# Altium schematic sheet Power supply.SchDoc (part 3 of 6)
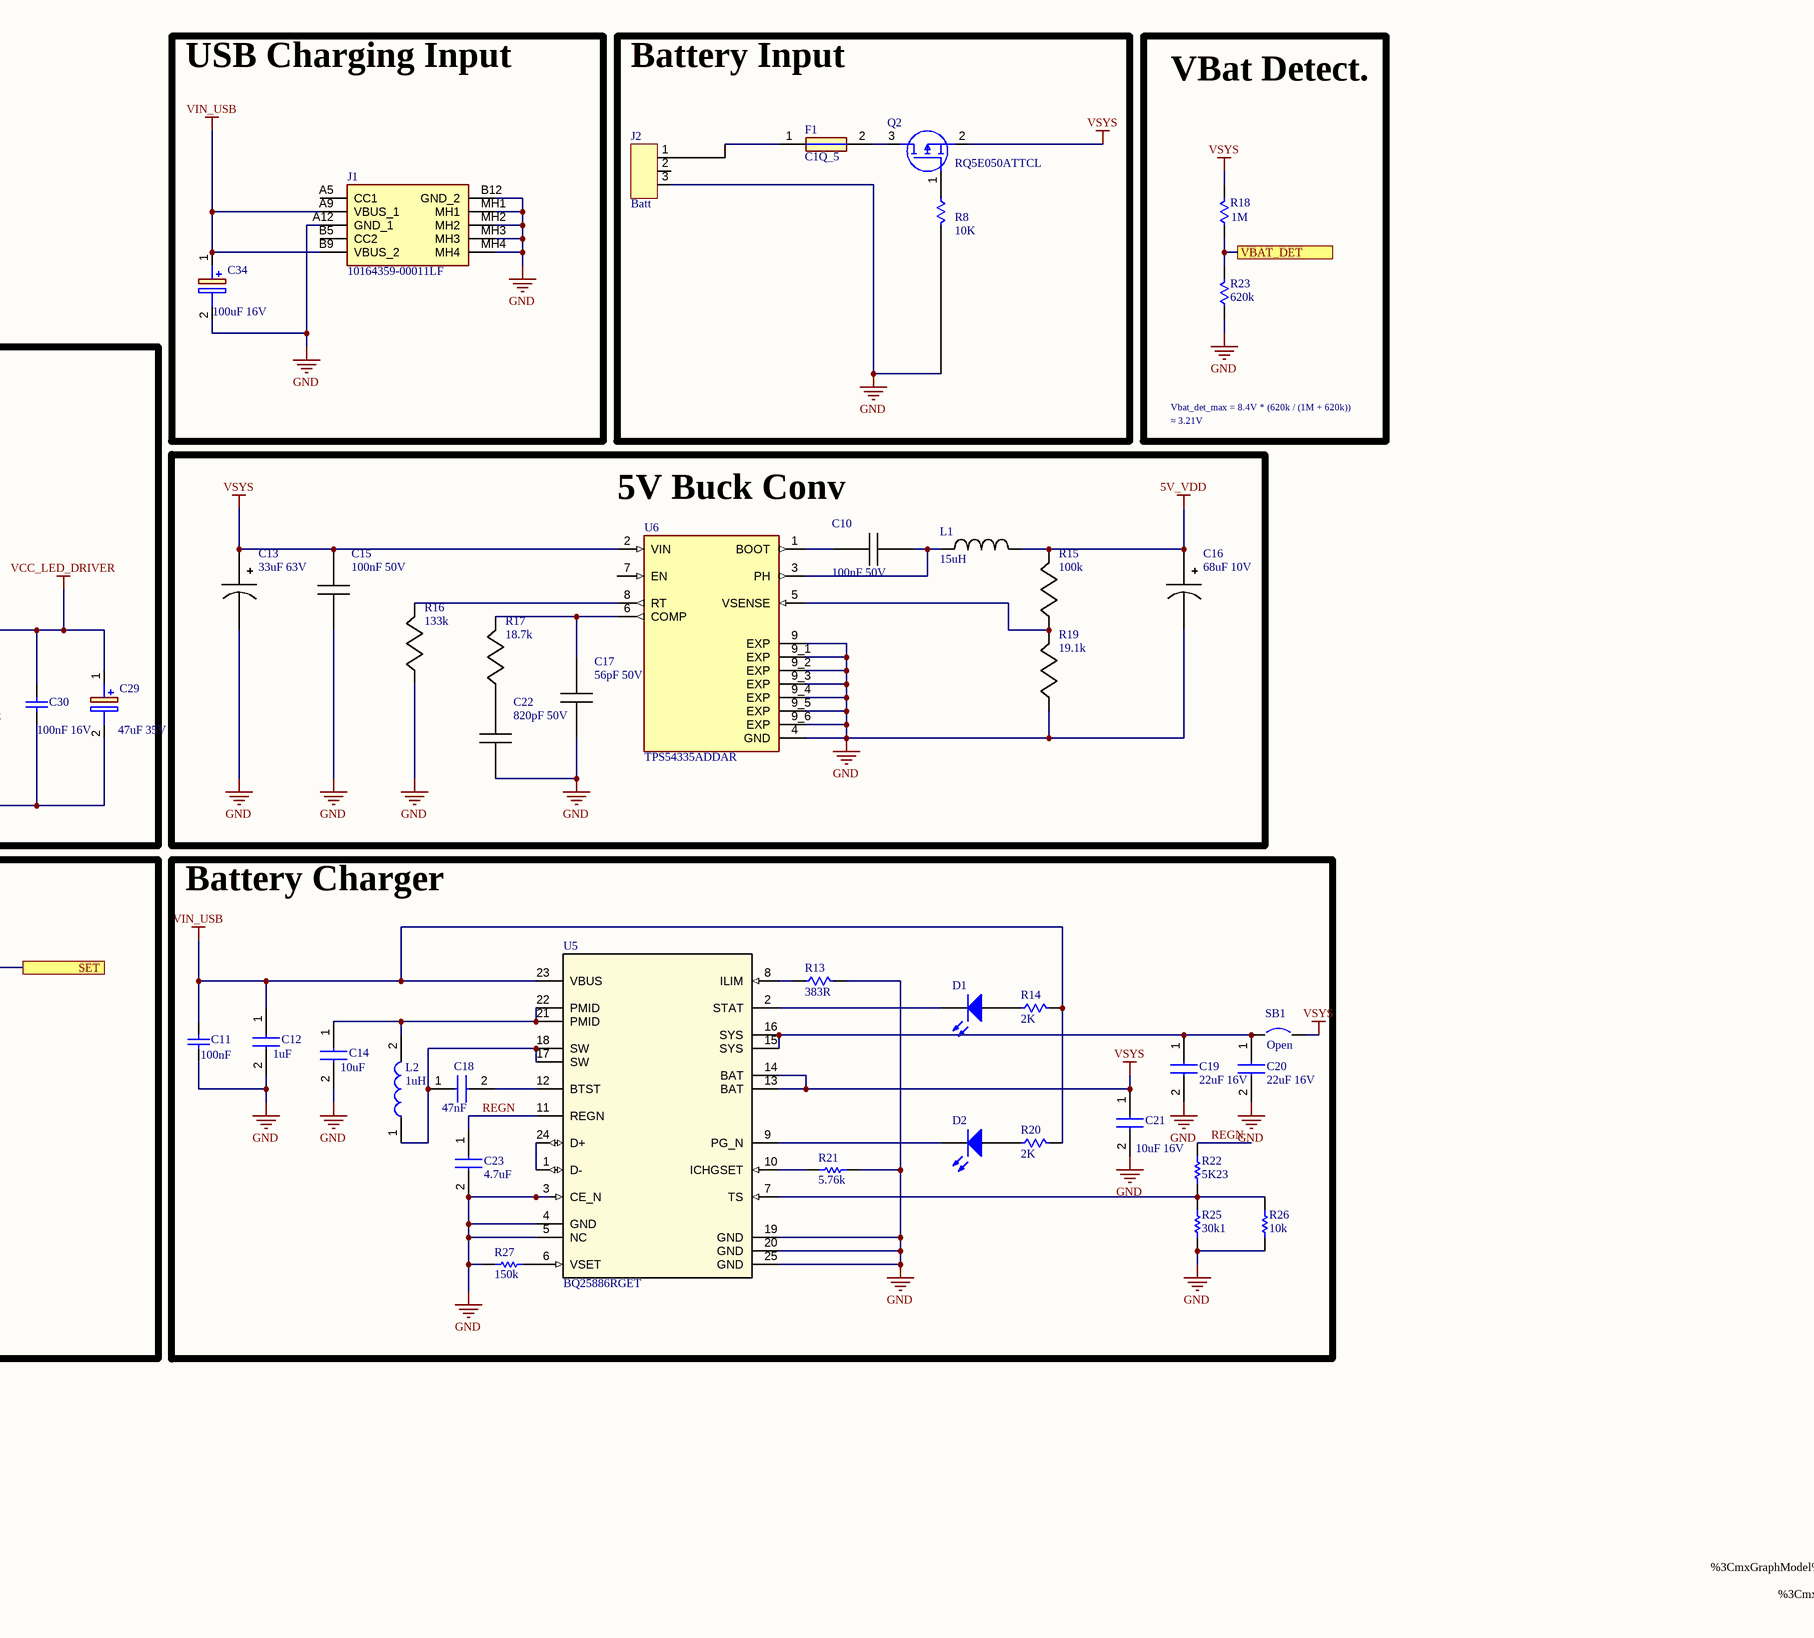
[diagram p3: Power supply.SchDoc, right]

## Notes on the sheet (continued)
797N0NHBMiwkMCYqHFZUCbPTkXLgFjFR4f5%2B7o4OljbWppASb%2F1qAlYWxpGhQzOTRqvnm%2BzVFJK8Cwp1IiIi1Gjh%2BkvUq4E3FHTajzhHDzqbNkZHrY7Yt2%2Ff7t27v%2FvuO5IY2m24sbHx8uXLsKastLS0oaGBLGpTU1NsbOz%2Blo3nMJw81W7DOHXVqkTH0cFy3rxAZBqU6GgFdKwsjDXR0WmoF7dqQ48cdXQXFmy1LcgJOVouJnehqNnMNAk6q0IsxCKeTkHnY9e%2Fb9y6l7LvF6wA0HnLuPOuLVN3bg8l98T4oA9sTbp3M4TlY%2F5%2B7v5%2B7qC9RDYPmMlKESRs2xK7bUssLqrXXa12gJxJoY56Y7b%2BKjVq4A0FHdCsZPBs9Sq%2FKLoyslPL9oZIdB4%2F%2FuHixQunTp26du1au%2BUAVQt29%2B7dCy2bqhe2VXr2oBMT1Sx70xHomJsZZSaNRvVSVXu0G1c2sTSfo%2BsPXLDVNjPZe%2FuGQHL%2FNnpWm4AOxf%2BD%2BGJDydGkL3wH9OrZJSRo8GFFlpERdMh5KwhTdHQoCWSyJl3X7euePwp19IaSVf3A1U7%2FJoIOG89Wr%2FJbesNBp62G9nZ4319%2B%2BeXJHxuDB6tm3zq1tdKWjcFAkUoP2H5AJzRoMDo%2FUrVfu1g25VV%2BuQz3Emy1Tdk0jDIlNOfjLgg67%2FTrxuFw%2FH36r19lqQuJzjv9uhkaNk9ONfu6unCbupfHwRxfqdA%2B%2F3DE%2FqwD5C5IWYOgUyOtDgsJJHd86pfGnd3tHR0sccez%2BoCyGtALdVT9rjVP%2FyaCTrsS5%2BinrlQajztw4l9%2B%2BUUqlfr4%2BPD5%2FOjo6OvXryt72Nu3b8fFxfH5fCcnJ6lU%2Bvz5c2Up2ce3H9CxsjA%2BmeeiRtd2vzZXvXmrvn26du1i2LmTgRb3d%2Fp127I2kA46nu72cBdyub6jo3ZWXb37rhk%2BAofDMTQ0eN%2FyrcN7x5Dquhie5NHP5O3On01pdqRF3z%2BwNenaxXDKZDfzgX%2Fr3s3Q0NCgezfDPr26UgZvisoO5az%2BUFkN9O3TFRqAXqijxpeuxiVvHOi0N3EOA%2BhMnDjR7a%2Bbs%2FPLBRQ4cdABVl2xH4w7dkoAnc8%2F%2F5wN6Kxbtw7s07Qf0JkwYcLEv25qrLqCgUE9X1eq%2BuCEexn36MThcLp3M%2Bxh1Em7e8GhODroBAZ%2BSd6Fz%2B3D5%2FbRFuhM4A%2Fnc%2FtYDTOGW7zbvzt4zaRzTMmhsaijQz8rFvE%2BsG12nA7aysOGGI%2Fn9hk2xNjAwKCHUSdlgzdDPHgUCZo1UFW71Qx5vtanUKijd2muBrWocckbBzrw9bYT7Rz4VhVOXdGHDRhEgHX0oNPxoOeXX35pbGwsLS0tKyu7efMmg3cwmUx2%2B%2FZtqVR69epVrU9dHTta0K9vN4Z9ZUQYXUdHWXMF1mG%2FvBxHr7i1I25c2cS%2BR7tcPkONpcVAOW8bd8b7ajFQJFQAOqjgAjcCyNDF1BXkb2v91nhuH%2Fr%2Bga0Jgg797Hhun7eMuwDl7Fj%2FPpLQqhALAwODXj27qFRL5Er7UqE96mKrlEnHS4yaOklJSezbuT6lejXwZoFOUlISgE7fPlQZbBt%2BSHTQUTZsIOtQQOfDMcPoI5PPpIkdjwb0T6SjGsCpq1YtIwcHB1NAx8XFxVX5NnHiRJVcQMCXaGVhHLd2BBubOo1Pai%2BWTVGbcsz696mvv%2Fu7A86P3OxBr1aYnU7%2FmtSIUQg6X381l8xqx%2Fr3d6x%2FX1ugE7rowx3r35826R24RZ9eL%2BdHoNNT47dZv0fEq72a%2BOT7K9JzS3938T1siHHXLobse0tw8X25fMbDupIbVzaJRTxV1%2F%2Bzv9frlfLd%2Ft3hjTg5Oak3eOuvYl8DbxboDBw4ENoWwyfh620aFjRYbSlr0KyBkaFDVVr6QQEdbfm64vP5WhwU79%2B%2Ff%2BeP7dmzZ5BzXV3dH3F3UALx8OHD%2Bj82jNRiSfRZ6aIGEHSOHCl4p183hj1q9VISdEjmZhNevnx5VsYucBnN%2FOfeysI4aNbAy%2BUz7tfmKuzRmp42XLsUVZBqp4ancZTlgFVf14kTgHKqqqrkcnlwcLAaWEC5JCbiS%2FrUlbOzMyUZh8PR1tSVmZkZPXMDRRslmaIkzXEgzvnXv%2F71%2F%2F7f%2F%2FvPb89e%2FPKo9ubV995rNkuYIkior79bX38XF5wLs9MgBrxfQR8L4pwn31%2BBNwheGl6jCSxfb9NQnQ0HaDFSIpEobOH6SG3VwBsEOijOYRC9ZiWNkoi4sJcJxzJ3xBRa4nN747USETd%2BrTUlgbJDCuiwGS3INBKJ5MMxw9Yss0hNsMWdO6bnFB9XLY6INTU1sMxHKpX%2B9NNPkDMZ2djYCJEwqwKJv%2F%2F%2Bey2WQZ%2BV7moAQQfHLWXNlbK8nGyKbMLLly9%2FdOcQzoa06prKbqRJZOjQc8Vu0nNLa6WJ92tz79fm1koTq88GFaTaqerCEx4KKcfczEgmazp16hSHw5HL5VmZafYfDpfL5Tt3xiEKmLzduV%2FfZvLr26ercY9OYFC41d8B73R3HG1EBx2QiODlw977rw9sTbQFOnYfDEHdGiy%2Fv0%2F%2F%2FQkjm%2Fc98%2Fbvmbcu2n3wINOAgICEP7awsDCbEQO2r58CCV4mThi5JGAQOAZ%2F%2BmONXC7%2F978e%2FSy7KZfLnz59um1LLFhDBts5JcWFYEO5RloN4IhGFwF0GurFJOgoa1rtLV6TSTf0rA5NXWE7H2CqF%2Bpoi2RayecNAp1WxTmRoUMlIm712aCHdSU3r2yUiLiCrTbsv72C1DESEVd6LuxhXUlV%2BXSJiBs0ayCbyzUHnYhQnkTEvVw%2BnSy5di0jC%2FdMFyb6CBN90jd9eP9ONYy4x7K%2BwsgHd85D5PkT8XkpM4rSF%2BalzLh1tVh3Y7M%2BZy3WwCsGnVpp4sO6Evh%2Fz%2BbvxO9Lsfjc3r7epkGzBs7wG%2BDp0ldtqQBJOQA6dXV1Yz8cLZfLhdnpYBZv08Z%2FcjgcleZoKF%2B6YKtt2k7nNUsnkPuKJXxcXg7pdaGjY%2FHef%2BHaq86dDcAmofioG1jTWbBoKd1Q8vjx49esTXhpbuePRVieLn2heLeuNGPNldOzSg6N3bdvn1wuj4kKRyCur78LjlHBgo6NtalcLsezkMm5Yrdrl6Lgdau3Mo5Sva%2FgUMNJt%2FwW3xTSc0sf1pVUnw0Si3gKh4MeRs268BwORy%2FUaQVVNDv9poAOinOMeyhdNQDiHDRWdqnMRyLisv%2BiJCLu%2BWJXeB1Pvr%2FCXqijOegUC70lIi7Kh6Hk9mMG%2BPm6iYoO04fDAwcOLFu2LDo6Ojc3l35WYUz6hpHxYRzYHz%2B6AWkKBZMwEkHnWPoMjLz230KFuekjX2UNVFdXg39yhd7LGxoahEJhbGxsRETEzZs3cYhS1vI1l%2BjIfroGnwk4YiRdFii7KT3e38%2B9UlJRI62ulFT4%2B7nXSKthF2anwcQKxtRIq9F3FYVyjHt0mj17Npq88%2Fdzh%2FAwi%2Fc4HA79puxj2FhGNjcz0grozJkzp7Gxcc6cOXQXEL7epnALNUAHyLLk0NijeSvkcnnCxk%2FeMu6Sl5cnl8thVXmKIAG1mmDSCuqHBB1zMyMgBijGa6SgA%2BIcHA5UdY0OwjAcDn5Xb1Loha1f32ZzShwOR6%2BpoxnJtHI159mbsdna2kJ7GmDaXVlvJdhqIxFxv79%2FBqoE5qGUJabEW1kYA%2BjAtfduHX71oIMlP1%2FsSiLa7qRt5LC6bNmyucQWHx9PnlUWJkHn%2B%2FqXjhr0oKOsutpP%2FIULFyKJLTY29saNl5z64sWLhoYGPDnWbhhliKI0cjj83UxcVFQUm1kqhWmWL18u%2B%2BkafCZ3rqWKRbzQIKorSoX3pUSC6AUmUGDeRCZrAu%2FZJcWFlZIKOMQYczMjOuVwOJz%2B7%2FQBDwaODpbmZka%2Fyyq49sM5HA7DBDelJAoPf3e9JMpdLBSVkLsgI5si0eFze%2FO5vTV06unl5SUQCMaPH%2B%2FSvLy8NynrUht0VoVY%2FK13V5A3kCwol8trpNXwyGEhgZWSCnATwQA65mZGVhbGni591VClUli3ryYSQOf7%2B2ehrZ4rdlPJfgGADlz7%2Ff2zDFrYXbsYcjgcExMTsVgM6fW%2FWq%2BBNwJ0pFIpUA6zEQhPl74AK99dXA1CkfUrh7P%2FqNavHN4y8zX%2Fu4urAZJYqiRrLtEJnGUHJZdWhtFLbmNt%2BvjxDzD0ZmRkEJDzMnjs2LFWB2YSdBoevPTV0Cro1Fw81GrO%2BgQvXry4e%2FfuNypuLOsNOQYDO3bswGvT09MxfhzPhiXorFmzRiHEsIkEHZ0rZ4OuVobBv3y1xz9hdhpIFwB0zM2MbKxNyREXjFTJ5fKwkECFlGPcoxOQUI20GkDH3MwI%2FmS%2F068b%2B2%2BfnhKGyVP5TuQOz0ufquM6fOgzie8ziW%2FfstHDcGqiiyOegvBEF0d7e3uMH2H1LqUkaoPOx65%2Fh8k74x6dvv5qLtAMyG%2F8%2FdxTBAkyWZO%2FnztUOE5d2VibOjpYsmlFlHK2w0OcdPvuojqTbutWWopFvMvl07%2B7GAXvXdlwgEKdFStWaH2A12cINfBGgM4XX3wBoNOvbyudV9CsgahQzF6bGL5SKwtjkAlBDjP9BrD8ejUHHUcHy5l%2BA7DkdNWiiooyGNuio6PpoMNGqFOQMi0vZUZeyoysOBecuhKlzYFIYaLPg7tX4Ran8r7JinPJinNJ3%2FShXkcHkYI5cPLkSfCF3urvlClT%2BHy%2Bp6cnc4Zw9saNG8gxZKCpqQkSkJERERHV1dVspq40Bx3o%2BsUinhrLwvGzooOOuZkRCTqgKpsiSFBGOeZmRv5%2B7qBaWyOtBu%2BVn3i7cjicd%2FsrFf1iARgCpB4rPqwy0LGyMIZTbxl35nA4YMt42Hv%2F9W7%2F7hC%2FNcaKw%2BHAGqikTe%2F%2FbuFw%2FarmcRRwBLRwUN3VxtpUJmuCpU%2BagE7nzgbwgGEhgXK53NPd3tO9eQW%2BTNaE4jRAn21bYiENHMrlcn8%2Fd4bKeV1OaTLp1jIc2OKrZxBbovFAExMTPZfoqAbeCNABymFpJBDUHknxr0qfJZ%2FbW9W%2BWyugA%2FJhiuAaS15VdREGtg0bNtBBJzk5udVRk1xgpV911Wp1qZqAJejEx8dfvXp12bJlGoIOFi82NhZZJyIiYtWqVa8AdFIECWp8JtiYMUABHZDNgE4xynKYKQezQnUTGKqDg4NfMeisX2Xp79MfeqqkTTYFqXYWLaBTkGpXkGq34qshHA7n63mDC1Lt1kY0z6ytDrMoSLWbPnUAh8P5wNbE36f%2FuwOMOBxOz549nz59Ck%2Bxb98%2BDocTPG9w83B71O3sxYazFxtYKiN%2F7Pp3BB1HB0tcReXpbg9hfz93YXa6MDs9JiocqjEsJBBiOgblwEO9muHA5O1mwOVwOImJiToa6d%2FwbDs%2B6CQmJkIbaldGArGHpbuAYCP%2FJ9NIJJLRoyz69OrKsOPAVl5eTgedq1dfCmMwGT1w%2B%2Fbt2j82tI5z7969P%2BJq0UTvo0ePbvyxoeSAnqE%2BhqwBlqATEBCQm5vr4%2BPDEnSamppIlAGmSU9Px1sXFha2CeiQ7V%2FVsL%2BfO8ybgIKIjbUprm2ukb6USMEpNpTj6GAJ0giZrAlcVy5ZPLdViQ5aQIG%2BRbu%2FoEfYtYth925%2FmuaDFem%2F61mDoTmchadYBRw1alRdXR2ADth%2B%2FNj176tCLFaFjVy1lLdqKW9RgEXzvmhBQvwm2D08PGyt%2B4QtGgUJmhOHWAwbYoygo%2BoL0qdXtQZI44FvOJHo6PE7Pui0uqpc1Uap9fQUiY67u7sL4zZx4kQK6AwaNIihqz1%2B%2FDgObE%2BfPo2PjydZJyMjA8%2FqA21VAyxBBye2WILOixcvqqurEWUiIyM3b95M0mdTU1NycjIkAInOkSMFxj06Mezh4SHk1JWnp6eTk9M45ZuTk5MaLiAYvjJcG4WKsaijg1eB1gjDjBWZEqZj0D8loAOzRAdAx%2BTtztra%2B%2FXt1rlTs7NxDocDoPPPf0ZbDn8PyrltS%2Bwwi%2FdAJm1jbRoeHsLhcJhZB4wDQYYKf%2F%2B8vLdiA8qGhs2ercjd5G2d%2BMrAd%2FEmBxCd9SrJumCdDg46qIas4RoKnX6BFNBxcXEZN24cT8kGtsUooMO1H%2F5u%2F%2B6UfYRlvw3roxWO3FevXs1o2R4%2BfKgwgT7yFdeA7kDnxYsXTU1Np0%2BfLiwsPH%2F%2Bpa0j8umamppu3LiRnJwMoJOXl2doaMCwh4QEk6Dj4eHh5OTk6OiosME6Ojo6OztrF3RAsaZSUoEWeAMDpmEYyeDTKT4cDgf9WAH00K1L%2BPu5BwZMCwyYBuKcsJDARQsDBg0axAZ0tNstwOobKDCo9CbuioeH%2Fd2MjY%2BPT%2BdOBqB%2FI5fLncbZAesEBkxLESQkJGzfRmz79u0jjv4MRkdHk9DzJ%2Bv06hodHf1nOuWhnTvjcK2%2Bdh%2F%2FDc8NjQcuXLhQFyP9G55nBwcdb29v%2BLDb81dEBx34i0wfOdCCKgV0cMEI%2BZjaNRhIDo36sNZrQKegw6a0KhkMpIOOQtYBytEF6JDtXGGYjSwHL6Qo0srl8ujoaJVAx7hHp86dDeg7aXLQ5O3O9AQIlNBNIZaNsB4il8tRG0Yul386xedvfXqhHlLkMveBLUo5dXV19fV3KyUVbPYUQcK7%2FbuTs13IOrAmv9VM6urqUlP30x%2Bkc2cDirwHVs5TfrHO9QF6DXTv9nKd%2BRsOJbp4%2FA4OOtB90P%2FG0RtZG8YoBB0nJye6r0Q0adomoHPnzp1i5VtJSQmbAVWfRmENdADQcXZ2Jpull5eXq6urc8tGkegkJGzv3q1ZAUWNPXFXHKyrYvgtKspnI8uBTx4oB9ZnVUoqPN3tJzh%2FyFJHBzuN7t0M3zLu8rHr38l92BDjoUMHo6Bo%2Fvw5BgYGZAIIjxj%2BFkwUotTZuEenQYMGUUBn0cIA1DJunmv78XKp0H6MrUldXd2CoDlYEpYBOutQ5MH0Q8hZmJ22f%2F%2F%2BYUOMKQ9iYGDg6TERHzYowBkXHJEBtU0JsHyu1zoZrjNfv369Lgb7NznPjgw6K1asANBpdVV5234eykDH3d2dMnK0LegsXrzY3t7eQcnm7OyscAjXR7KpgTcKdOLitqOzJ1UDoGlLWj2mh48cKUDRiLIZK%2FzkwTcT6P3A%2FBd7HR3MpHs3ww9sTWBEP5i9%2FfCxsj1JkTM9O3%2F12d%2FIfdHU7uHzRh8%2BVnZYVHiq8CNIT%2FEMAAW2tqJKdCjrwuRyeVXFzHUrLevr786ePRslQ60G8F8fyTrQTzL%2Fdu1iOMC0uzA77WxF9ku3Esd8xJcaxJcaZs9ZgF0TGUhIPNic4Pz%2FIOvoQQfbDD3wbv%2FuoKdla2v7JkOJLp69I4MOqCEbGr60BkFvWO0k5jUCHScnJ9SHpQT0oMMGaJSlAdDZtm3b4sWLKRWr8JC9MrKyO1LiNZ%2B6Yi%2FRwbXKanyAIMih%2FAFQ6dB6%2BDvkfdE2DKg2pwgSEnfFq6qj07XLn6AjLMg8Wi7ekxhJ8egJh6u%2F%2BvBouTi%2F5NSpgmbQObx3jNfEv%2Fft0xV2sERs3KMT6OiQU1egGdO9m2FwcLBcLv%2Ftt98unfg0MnRoff3dRQsDTN7u7OX6dza7gYGB8X%2B9dIMDrKPMdTklHuwHZmWm%2FlB%2F5CW46EHHzIhsS5qH9SrJuqCcZ8%2BedVjQyczMhD8oKBDWvBXqKId2CzrXr18vKyvbsmVLZmbmqVOnPv%2F8cwCdLetjVy5fShmA9aBDQQeVDk%2BePOnp6blt27ZvvvmGUrEKD1930Blg2l29XeugY25mBKwjJ7ZW7ejAgIQdgqGhgb9Pfxj%2BVQKdVSEWFDkKaLqgxWGYUwN7fWC1GUBn364pYhHPbqRJff3dsJBAdJuFshMMnMifevlcWvWlzOpLmecTvRI%2BMVo3octWj27bvZr3nZON9v3DOOvbLw5nJx%2FOTj6UlZS2ywUdmJMBA4PmRWH79u3TEHRQI0qYnY4L6MD%2FOdpwAgtJ4N8DzDnCy8HaAKOFWP%2FgnDUsJBBMD6C1azSnJJM1bdsSK5M1OTpYCrPT0IsF5ACZg5VFskg10moQ8qF3EXoxSKNBjg6WMlmTp7s9GOnGBoWaVWDkibwF%2BQjmZkbv9PvT9ZWOhvw3M9sOCzpOTk7QgzA4t6I0srY6bLegI5VKS0pKvv32k%2FPyswAAIABJREFU2%2FT09BMnTgDoeHl67kva8YpBp7GxMbVlu3btpfcJlTBC64lzcnJ27dqlxcKARIcl5bC3jMz%2BwV%2BlRGfbtm2U0Z39YV3LppIIh5KYItGJiQoXZqfhQFtSXHjkSMGoUaNUUkb%2B0y6fiKcJ6OC8EuBXjbQahlhyNPWd4nbv3t2ePXtC4lZB50JlPjaDH%2Fb43v%2B6%2B%2F2vuz%2BMHvYwehgE7n%2Fd%2FWnZS3d4z549u3R2G0ISBkoOjUXQOVuRDbabxWpJdGAxPyILCNKACerr70InjC60kBVASxoNJoHLdOyxQQAWExUOFIWXw3wfeS9Pd3s4S7m2vv4uJpPJmjBcKamAzKEkUAyY7oR8SGYCg9HwsoCeQU9cmJ2u7KkBUrEw5mZG6PpKKpW%2BmVCii6fumKBTX18PXSdpcYtsTO0q%2FHqBDp%2FPd5040XXiRAigvEETic7Bg5mHDh0qLi7GHpkMNDY2enh4TJw40dXV1cfHR4t4Qd6FfXjBggWuLZubm1tFRYXCCysrKw8cOJCbm4vONxQmw0gAHb%2BWDauUIdA%2BJToef90mTpyoUBk5cVc8TtaoGqivv3vv3l0Ku6h0SAEdHNJwTJXL5bNnz2YPOmDt7aUBYs1Ah702Icw6de1iWFdXxyzRqboowmYGoPPDHt8nwpAnwpDHaXOeCEPuf939JwJ0LpzegnyDAQAd4x6dQBlZbR0dF6eBMOQj35QUF6JEjQI65mZG%2BFLARCRwDDoTxW4cWAQFJyAEajE60OwNDePJMOXaFEECio5IUVOlpAIFMACdnu72wFue7vaARJgVHXRksqaS4kIba1NQLUfXGehxFq%2FFQN8%2BL80a6VWStUg8HRN0Fi5cCKDTbq0hY7OmW0Z2cXGBGaKJtG3ChAmg60f27BKJREfLy3%2F88cf79%2B%2FX1NTcuXPnwYMHCxYsQB0dL0%2FPBfPmTvObioOx2qAT8OXUBUFzY2JiwsLCUlNTsVPGwK5duyZMmODZsrm4uERFReGpVx%2B4dOnSxIkToTATJkxYsGABvQz379%2BfNWtWTMtmY21KT0CPAdD58ssv%2Ffz8sEoZAu0NdPh8Pq21NkdMmDCh1eXl4ESJ%2FFXYnuGT0cXUFX6M8B89PX2%2FSquuKKCTnZ9x9JR4967IhVO60PfIJR8ePSXOKzkJOjrk1BVLHzVY2r59unbv1gw6SxbPZZi6ooPOw%2BhhjUXRj9Pm%2FLDH93HaHPag07dPVw1Bx26kCTiWB6EIuP9kAzrgiQynvcDJKFYFgA60DblcTgEdeK3ATCAkk8vllGvhLCARCTpIWng5WuKGGFLhjA469fV3t22JpYAOWQN0iQ5aSdarJOtBp5UaaP%2FWkPEzUwg6yoYNGDnGjx%2F%2FakCHMh4vXryYBJ1pU319Jk%2FCwVht0PFwG7vim6VJSUlr166NjlZg4RBAx8PDw8vLy8nJqW1Bp6KiAkfu8ePHz5w5k1JLL168qKiomDdvXlLLZm5mhK7j6SkxBkBn8eLFbQ46BQX5nTsZMOx0g4EMzRVaLGV5OTk24N9lckSRyZrQTjH5paDPTrL9qxqmSHQwf1CLkcvln%2F3jU01A50jOZ4cyFgriP45YOCDgiwmF2XGwJ2wKGWpmmLzF%2FlDGwvS9ASAsIUFHPW3C%2Bvq7c76c%2FU6%2Fbih9oQTooAOzV%2BQvS4kOFXSOuonL48TlcQmbpgwaNOjrr7%2Fe98cWEjx3TcS4nMyQ5gSnvsUioUQHkAIFG%2FD2wZ41TEuBgg62CoAYBBGFoINTV5CsUlIBU1cIVaDqpHDqqqS4MCYqHIgESoW3htxAGkQWA%2BQ6pKVKAB1IAzclw5gt%2BdR00DE3M9KrJLcywKt%2BugNKdNAaMjnhjd1ZOwxQpq5cXV0V%2FjnGSBcXF7Jzl0gkI6yH0G32u7tpeb03BXS8PD2nf%2F6ZVkAn9p%2BrMzIyflfdUAg6ly5dcnNzG9eyubi4XLp0Cfng1QcaGxunT58%2Bbtw4MN547NgxehkqKioWL16c2bKpBDpYma0GdCfRKSjIJ63%2B08N0FxDurW2enp7YYpcvX06Cjo21aUxUOOw4oijs%2FeHLhZEDc1MjQAGdFEECLlCHAjx9%2BtTZ2VnVqasvfAdkJo0m97AF73E4nHf6dYOSv23cmbKOCQ5RP4n5jso6Llhe3r2bIcIEJaAL0DEwMOjVq9fgPzZ4kLeNOzs6WMLO5%2FaGqjgtmgw7HNqNNAkMmAYvMSwk0NPdvkZaXV9%2FV5idniJIQCzAcKWkAtODvgvoxISFBKLmMmj%2BovN5eJuQ2MbaVJidDvo3gQHTmK%2BFGoZk9fV3UwQJ4KPUxtoUfKhh8YTZ6ZWSCsicbMz%2Bfu6YplJSAY8Gd6%2BUVCh8aoWvFQ3qrFixQvUxXX%2BFghrogKCD81YK1ZB9vU0FW20KUsfEr7VWw6hDWNDggtQxWUmjwoIGK2yjDJF2I03WrRxekDpGsNXG19sUU1JAR9W%2BWyKRvPfeILr9DGfn8fQxWJMYEnT4fL7P5Enakugwg86LFy8uXbq0dOnS6OjotqUcqL379%2B%2Fv2rUrPDxcIeWARGfx4sUZLVtm0qh%2F%2Ffxjq9X%2Bu3OGb1TZYmNjW81TpQQUZWRfb9PMpFH5qWMiQ4daWRhjWzU3M4qJCictI6vaXCmgAzl7utvDP%2BAaaTXDvJUuJDowj4B%2FsiHg4%2BPDjB3kqiuYa0B5DIz05mZGoGwx3KIfxLzTrxu43R08qO9I26EjbYfCISifqv2vrL7%2B7vz5czgczo7171MQBw61DjoZGamDB%2FWVE1t6%2Bv4%2BvbpWVJRDHC6JQv0n0LAhW1HHCIcGDc7fb5eZODpUzeHAMn%2B%2FnWCrre%2FHfw4HUDOokqxg0NZHqV4DHRB0TExMOByOwglvX29TiYiLe5lwrEqsI9hqg9dKRNz4tdbsP1crC2PyWomIi6yjOegoHBu07gKCBB0vT0866DQ1NT19%2BvSnlo30HMk84nq4jW0VdJhzaG9nQaKT0bKJRVw2oNPmj0CCTtxaa7GIi3tm0iiynWsddHAtcUlxIbid%2BnKmF5%2Fbm7wphuFvsap0RaanSHQwZwxcvXpFPdBBR1SgaTt6lIWzszPyAEggSC0T0j4hezVkLCcEfp%2FoCfk6kDTkQ8EdrYOOMDsdtGpgugdmgmCSqFJSERMVDnNP8FpRyVcma6KU%2FHU%2FFGy1FRfxcI%2BLHcH%2BiawsjPFCCATNHEhebvJ2ZxD16X18qk41Cq7oaKBz9OhRaB99enUl2w2EATUeP6p6%2BtMjaWWYRMRlL5jxdOkrEXEvlvk8e%2Fbs6U%2BPLpdPl4i4yrpj%2Bq3XrxwuEXG%2Fu7j62bNnD%2BqKJSJumXAsJGsT0Pnpp59U9ehJgg5IdMgZFicnpxMnTgiFwv379wuFwjNnzrAcvDs26Pz4%2BNa%2F%2F%2F1vllWh02QNDQ0M%2BR8%2FfjwiImLbtm0lxYWAOD8%2BvvX0p0dXK8PEIi5pvVe7oKNQR%2Bd3XYrzJe6ZSaPp%2F0N0DTqg1rpt2zY1JDogwNi2JRZG%2Fby8PKCcbVtiSRoAmy6Q2N%2FPvYdRJ02MmsLycuMend4y7kJBHB1JdBB0YqLCzc2MQDEFnD%2FAqnh4WH8%2Fd1hoDfzXwUCH79BbXMS7WDrl5XBwarq4iMd3UEzn9OEgMmSouIh3tXLps2fPvr9%2FVlzEK81utr6DO6oke3t7Kxi39VEq1kBHAx0GL54gU7lcPh2q6MfHt1SSygTNGigRceuupcLltVd3SkTcmX4DsGkyB0Aa9PSnR3D5pTIfiYgLl%2BgIdGDqOuDLqZTh7erVq8uWLZvbsm3YsKG2tpaSQNkhCTrT%2FKb6TJ5E6ujoQQfrjZToPHv2rM1BRygURrZssbGxx48fx3JCoLq6Gs4uWBAol8vv3zkp%2FoPIAcrFIm5k6FBs3toFHRtrU093e1CGOFKU%2BUP9kR%2Fqj9y9kX65fLpYxBNstcX7QqCdgw4ukPb3cweJjv2Hw5EGQH0VPGpB2M%2FXncPh4LQX5WHZHLYKOufOZDQ2NoKctS5h8o2F3en7Q9EGSPDo0aOKkpV0YILl5aCMjKAjzE4PDJiGWAPTmsB2qECDUi7SFBCb52rnaWb4DRAX8Wqv7oL%2B%2FM53qeIi3gwVhoNmadCPj2%2FB5ZdbOIkyR6z38QmVo5XfjgY6IM5Bl7zk1wKgc77Y9fv7Z549e3ajaqPkrz04mZgeBolO9dn5UO9AKuwlOpGhQyUibu3Vnc%2BePXv8qApkS3AX3YEO5E%2ByzsOHDwFx8HfJkiUsRTsk6Hh5erpOnEjq6GgCOjHRq1JTUzdt2qRQGZkyMLf%2Fw4qKikWLFoGFwzaX6KSnpwPH4C%2FJOkg5y5c3%2FzuXy%2BVnKo6IWySX0AtfOTtfpxIdtF2LUzzg3%2BDZs2fAOhShzusCOqij806%2FbiC1ArO85AogmawJdH2YpUf0voiMIUHnpXkbEY8klbNHvI7nLyotWFxasPhovL1o3ZAvHXtMG90Ndrf3DGc69PhqukPIV%2F4hX%2FkvmDd5VYgFfQ%2BeN9jAwIACOvjKKiUVAHM21qagzCuXy22sTdWmnBppNYiLyCdtV2FPl77iIl71mSAYDq6cCRIX8Txd%2BrIsJEh0vrsY9ezZsx8eVcHsFeVaVEnOzMzUymD%2FJmfSoUAnMTERQEeZ%2BRyQypC6MpRulNLUyEMrC2OQypwvdoUcsv6qu0Ampof53N5wFV6uax0dsgxVVReBD5KTkxFxMJCbm8uGHiigs2DeXFKiw%2BVyZTLZ05ZNJpOxyRDSeLiNDQ1ZsmXLlpUrV3YY0Jk7d%2B6Wlu1csWsb6ug0NDQg32CAVGTevHkzxs%2Ba%2BQ%2Bwa7Ju5XCxiHuu2BXmsEr%2FmGOFFqVdiQ5MfICQYF2055XTs36W3ZTL5c%2BfP79yNkgs4lH%2BS2gddFBhFoftZkMs6k5doUTH0cFy9Khm9w5TJrvBymQY%2BEF9BxYNyeVyZ2dnhf%2FKyI%2BXOYygA13f8KHGM%2FwGMO9khnAVy18K6Aiz00EuVVJcCLpHwuz0sJBAqFLwhwBOD2CBFXlfhjA0CYAnhmRtfgp0dM4dcwNMyUwczb5IdiNN4Cq8nC4NwtkrJyenN5lRtPLsHQp00O0DQ4Ob6TegIHWMRMTNShrFnnIgQysL48jQoWXCsWXCsSppIsPlni59s5JGSUTcgtQx5JyXriU65mZGaJ83Ojoa%2BQYD8fHxbLiEBB0%2Bn%2B%2Fl6Unq6GhiR8fVhfuJt6u7Gz8sdDGbkihL8%2BjRo4y9czfHjBQkTMrJWvn48WNlKXUaf%2BrUSZcJPO%2BPXb0%2Fdi1IHcMedK5fvx4RETF16tTY2Nhbt25pXsgbN24gx5ABVBUnIyMiInbv3l1SXGhlYRzasrpQLOLGrbWmSNR1ATovrea79BWLeI%2FuHJLL5TevbAKxBOVb1jropAgSSP8P4AJCjeXlvXp2gQVcoK0il8vz8vJQGTksJDAwYBqIdmDJNMz4jBo1Sm01ZKgZAB0I9%2BrZhVzQTqk6rRwKs9Nw6goMzwDr%2BPu5QwB4MSwkEA0NQwx7HZ3XBXSah4OQoaXZ9qXZ9ippIsOL4Dv0zkwcLS7iFey3o1MOpAEnryYmJvX19VoZ79%2FYTDoU6MD%2FEg3%2FIWmlO1Apk1cAOrdrb8KoGR8fj3yDATUkOj6TJ3l5egLreLYQj9qg4%2BfrhtW1elWoJqP7o0ePtsY6LJ3PWRXcU5Dg21agc7qiDJ%2FI3MyI%2FRNJpdKAgAA%2Bn79s2bLr16%2Bzv1BZynv37pEog2FMv2PHDoyMiIhYtWoValeQj0CGtQs6MPa3eE9ME2an%2FVB%2FBMbF8yXuYpGCuQCtgw6osqEJH7i7Gi4gevXsghZ%2BIRPKoVwuj4kKJ2ng1KlTmqghw0shQefd%2Ft0NDQ106vcGQAeUjrFVoBtLT3d7fz93WARqY20K%2Bsjwq3BlKOZABl4X0CHLrKMwzl7p3UFoiGgdB3TWr18PoKNs3kpHbVHzbHUNOh5uY3Fgu3r1KvINBtTQ0QFNZJ%2FJk%2Fz8%2FJKTk%2F38%2FNQGnaqqix5uzQvQyHJigVUKPHny5FjhukNpSw6lLykWxaHcQqVMtJI4%2BOsAaBgoS2OT7b1793bs2BETE3Pw4MFHjx6xuaTVNMnJyYgyEBAKhXjVhQsX8KzaoPNRaxuDwUBzMyNyxTUgQvRKX2X%2FcbUOOqhHAqZ4hdnpWZlpgwYNYtabodvRAa%2Fjjg6W5Lje7NfCo9nhl7vbBNTGBRrQXA0ZGhis5UY7QH%2FMHTdhDBlgmA8ikzGEYSpK806PIYf2BjolxYXoUpSCa%2BBOi%2BFZNDyln73SkG%2Fw8o4DOra2tgA6GrYtyuV2I0343N6q7pRMmA8poOPq6vq7Yi%2FDxtIFBNyUbk3nwoULS5YsAcpZtmzZ1atXcdijBB49enT16tUTJ06cP39eKpUGBgaSLiDCQ76eM3smn8%2BPjY3VBHQoN%2B0wh2w8P7yCh21qaiJZJz09nXLT48ePA%2BsA6BQU5NONT5IxwcHBpMFADw%2BPcePG8ZRv48aNY3ABAa0U9Ffgl%2Flj0TrogHYwCJZIwzYsQeedft3AthuDHAUmIHoYdXrbuDPucJVCo6bMNUA56%2B%2FnDsaH8PfTKT4%2BPj5TfafQd8o4TWZFzwczpAQYMiEzVDvcrkCHIpYDjXJzMyNoMADHaj8pmwuh8XA4HL1BHaQWNQIcWYfY7t%2B%2Fr6N5K4qRQFKRmSFM0aBkbtAU0HFxcWEYOcaNG8cSdDzcxioba58%2BfVpbW8uAODAWSqXSkpKSb7%2F9Nj09%2FcSJE59%2F%2FjmCDujowNTVl19%2Byefz1ZboUMZd%2FaEuauDevXs3btxQlnNTU9Pp06cRdOjuRMiY5ctDKaDj5OSkrMWOGzcOXYOB1T6KZWRwkUiOnf5%2B7sLsNGWfDDPo%2BE3zj1yzdv3WuOCly%2BF29F%2BKwUCQJ4H%2BrDA73dHBcqTtUPa%2Brvr06mpgYPCWcee3jDs7O%2FYpFdor3PncPpCG%2FGVIrzATlpEBX7xL3gXDHA5HWa22q%2Fh2CDrgkwSaCkjsQPTI4KtEW1WKs1crVqzoEGN12zxEBwEd3c1btQnoKBs5gHLooGNtNYTuk8h1oqa%2BrphBBzSRPVs2LYLO7bMht07NfSjdQx%2BVb52ae%2BvU3Cd3RGqcaqw%2Frewq%2Bql%2FPX8M92pqqKJchaee%2F3QbT0FizKepoQpiMEH7D5CWkZn7aIqOjoeHB0ofx%2F91g1bBDDowqtVIq2F2AFwCweJkhcVgAJ15CxZl5BZl5BYdOFyYeigvduMWOuV4eXlRQEfh3FlwcDBLiQ6ADrmcu32GwXuowipliPT3cwfXUTjnha7BQJdLmJ2GnsJqpNWBAdMYcmN5qt2CDhQMZ1rBnRbJ6I4Oli06TM3aZgw7eUmrdYKzVzY2Nm3DCB3irh0EdGxsbHQxb2VuZqQQdM4Xu1afmS%2BtDL1c%2FoVCuY6GEh0YOdzc3AAj8BfHEbIHl0gkQ4cMprubdnHR1NfV7du3z5w5k5ycXFhYWFlZOWPGDFKig6ADDre1JdG5IrT574xBdy9E0eHgvzMG%2FXfGIIUMBKcabmRRrvrX88dw6smdI%2BxPPWu8DVchu%2BC1TQ1VcAoZiH6LhhtZkAavYh%2B4w25jnyHLlJqDjrOzM9ksvby8XF1dnVs2hqkrGDzg%2FzH5q4b38jRh%2FoGcwozcovScgn1ZOYID2V%2BFLKUUSSHowEwE%2BhZdGRHWs2dPPeiQszOwKh4sPoOPcbBEAErcQJ%2F19XffBNABdXJ4ZKgWhJWYqHCyDSsLg%2B42XtVqACwHcjicq1evdgjqaIOH6CCgo6N5KzroXCzzuXczh3xRPzU%2BulG1gYI7WgEdd3d3SjetDHQU%2FkWga%2BewHPOUJaMsLyfXlmtRovMmg87atWttbGxGtWw8Hs%2FZ2RlYAZoBxI8aNeqDDz4gjf4pe18qxbcV6Pj7uaPeA%2FT44K1aWe%2BvTKIz68uAfQcP7z%2BUe7DgWG7xyT1pB%2FekZUav3UD5gry8vIK%2Fmse81LlPr66qTl21TykOWSo1JDqANTAqh4UEgh8rEOSABneNtBqgBz2QK3trKsW3W4kOcAyADiAdhBHKIcEkb1eXCXz1dh73A3pd4ezV%2BvXryaFHH2ZfAx0BdDIzMwF0dLHeipToXD71hbKavXczh2SdDgk6ISEhH3zwwWglG4%2FHU2lkVZb4SnaLROe8liU6j5VLdOin1JPoYD5qS3S%2B%2FfZbBwcHCkGSh59%2F%2Fnlubu7YsWM7DOg4OljWSKvZ%2F8dVDjpzktMP7k7N3JN%2BUJCRvT0pJX733uWrouigczArnWFqzNzMqFXQsbE2PXOmvKqqqkZaXVCQb2BgQCJF%2BwwD6FRKKmCmqVUjAuZmRgA6Cv9EoesuXJYPOt1aMWfcDkEHlqGBhAamrjCmRlqNaAKgM83Ph97qWMaMc3zpABHz%2FP1F4OzVuHHjlA1A%2BnjmGugIoMPg34psLuqFSdD58YebDLVJynU6JOjcuXPnivLt9u0%2FdVaUQQyb%2BKpsm0sHBtUpAp1LBwZdOjDo4VUF6jtw6vvrCqau4BRSCJbhX88fKzv1rPE2nFI4dQWnyKkrSj7fX8%2BCGLwXy8AbCDowquHSa8pHamVhnJk0GtBBsNXWbqSJMtCZPNknfvfeHYLU7YmCLTt2b9m5e9uu5Nlz5tIHGM1Bx9%2FPPT8%2Fn57zaxSDFpwpFU4eKgMdoBxYoSbMTk8RJIAtIm2tPG9XoGNjbYraY%2BCkDJxdQCRUAlaajkDH3MwI%2FV4xDED6Uww10BFAB8Q5DMs7sSGqEUDQ%2Be7iaoZ6lMlkPzU%2BQqFOhwQdlqO1hsk0Ah1FOjoUCsHitR%2FQef78uUwme%2FbsGXvQOXLkyLNnz563bPhEmgTaauoKRjWK4RZUfc1PHSMW8S6WTblYNgV8fCoDHS8vr%2BkzZ2%2FZkbRtV3Iz6OzYPX%2FREoXkoQcdLy8v9qADDFpSXAiiC5JywE8ZCIfA6ztl4Fejv0UHqNgG1MtEk6t69exi8nZnNfaVEWFyuVzrEh1zMyOcvTpy5AjzMKQ%2Fq7AGXnvQOXLkiIbzVimCBIXiWfhUEHR%2BeHRZYQ2SkaibrBXQcXNz8%2FjrpkxHZ9CgQVAJ5C%2Bfz9dk5FN47ZMnT2pra8%2BfSDgrWnVWtOp0YURlaVxtbS1Lk4MK86REvoE6OmfOnElPTz969OiSJUtYTl3Fx8dnZ2eLRKLLly9TKlC9Q62AjttfNxcXF5bKyPX1d8nFOzDI%2BXqbikXcq5Vh8C8CfHy%2B%2BOVRff1dhQTj5eU1afLkWV8GBMyb%2F6nvVGVp9KCDoJMiSKDL0lIECbBiCJcXwZRNpaRCmJ1GKtiC6wwyhp6bGsDR5hKdrl0MDQzU2A3Cw0N0BDo4e%2BXt7U2OOPowyxp47UFn4cKFMLqr8UWBIXMwza7scgQd5nkrqG5pZSgIdTQHnfHjx0%2BkbS4uLsA6ZCcukUhs3h9K%2F%2F%2Fh5TlBvTGP4ao7d%2B5IpVJhok98GAd2YaKPVCqtq6tjuEqlU3rQIZVyKGHU0dEp6Aww7c6wR64Ko9vRUdhcJ06cCKzT6qorhQNk0KyBYhH3znf74eO6UbVRLOIxgw75XSgL00EnMGDati2x27bEgqrQjOlTmS0jd5ipK%2FpkE%2BnitEZaDR6sSooLQVQTGDCN9AsGCrnoLEzhS1TWrzLEtwfQGc%2FtA0432f8aGBjqDnT0s1csgUZZstcedAYOHMjhcNSetwLDlww6dCqBTvWZ%2BVoBHWXDBowcdDs6CiVSWl919eLFCzro5KXMYA86qSy2rZEum7%2F5cNfmRfS0m7%2F5kPnU7rhvKFftFSTAVeqdEiR%2BS8lQkPgtZIin6LfYHfcNpKFcSx42NjYi%2F92%2Ff7%2B2tra%2Bvj4qKoqlRCc7O%2Fv27dv19fUqOYrHO9IDKNHJy8sj5YL0MN0yMkNzhRbLADqODpaVkgpct0KOf57NPj65l8u%2F%2BOFR1Q%2BPqs4Vu4lFvMYf6xkkOsrghoyngA4pt5DJmmBqhtmOTkcFHegMwQgeueSKfCmvIKwHHYWV3LdP82JADodz9uxZZcO5Pl5ZDbzeoHP16lV49716diEbh5WFMUvP5ApBx26kCV6OoIP%2FLJVVpUwmO1%2FsqjnouLu7%2F3UGQMER2XFLJBIEHbLkugOdrDgXlOhkxbmwBx2y2MrCFBnG63jo4eGh7Okw%2Ftq1a3TaYK%2Bjo7tVV0VF%2BX37dGXYKRIdT0%2FPv86vKjjCp%2Fby8gLLyOQXGhYSKJM1gTQlJipcJmtC2UDcWmuxiIt7ZOhQBh0d8i4MYQrowAJpT3d7GF%2FlcnlFRTnz8vKOCjrQhYL6LUxIYcdibmZEvjKys2UZthtpYmVhzCYxHXQ0vLWql3ftYkiX6NR9t%2BfHx7dgFvXR%2FTPfXYyiCHt0IdEhS46zV3oTyQxDsLJTrzforFixAkAHXcbwub0LUj%2BQiBwkIgfB1veRV5R9YBTQ8fU2hWvLhB%2FGr7Um7ehUn5mvrBIhnlxhzn7qqk%2BvrlVVVQz9cqunAHRaSs4FzIKS6wJ0Ghoa7ty5899n9leLk2GXXsq%2Fc%2BdOQ0MDfdimx7T6LF5eXq8j2VDK%2FFqDTqsLjymWkdm8UzLN8uXLH905COxSKhwbucydtLoG3yPaubGyMJ7hN0Cw1SZurTW4%2BdQF6IBKkI21KZSk1eXlHRt00E5gjbQaJG18bu%2F8VDty7Zuy7lRhfIuuFU8s4pUK7ePWjlCYhoykgM66lZbNty7ilWbb%2B35sSqZsNcx36J2%2F3w6IRLDVlu%2FQu9VLzM2MKKDzP%2BKFv7Zsz549I4eA%2BjvFJOtoF3TsRppgyTMTR3u69IWCcTgcvYlk8i2wDL%2FeoEM3iAyYcvnUFy16wQ5ZSSOZWzYJOkg51WfmnS%2BeKBE5RIYORYmOhFAXUFi5KM6RiLgsQQe6VM1Bx%2BdjW0Cc6jPzQSE6fq21LkCHzi4qxZADnrIwBRpex0NNQOfDDz%2F8QPk2bty4SZMm2djY6E6i0yrobNrwDamjo%2Bw9KosH0LlY5nPlzHw55AO6AAAgAElEQVSxiHvt4nK5XI4iHDTfonAyy9zMCECH62AHas5q%2FKbu30Pa0QGJjjA7DYy%2F1UirMzJSR40axWAZuQODTqWkAt7Fti2xcrkcxGyAOFUVM6sqZopFvMyk0cydKnkWKed%2FxAvPF7uLRbzI0KFkAnqYBJ242BHiIt6lsk%2F%2FR7wQqIIlrEC2pdn24iJeVfnMqvKZ4iJewX47%2Bu3oMSToXCr7FCjn119%2FpYCOTCYjWUe7oAOUc7F0yuVT0wHyzM2M3jbuDH%2Fs9SaSFQ7BDJGvN%2BjAW%2B9h1AkaK5DKdxcj4YGrz8yTiByAhemtGWJI0BFsfV8icnhw59gfa8UdyoQfkqBzvthV4QTWj49v4nor9lNXQDnduxlSnHoqGyGUxUskkvQkd4mIiyU%2FX%2BxaJhzLcxielbFXIYg8fPgwNze3vLy8trZWYQIdRSp7BDL%2BdSQbSpnVBp2amppD7LYnT56o9I4uXLhw%2BvRpZX497927l56eHhERIRQKWwWdC6c3aAg6Tx6dgi%2F01tWdADqw8tHRwRJUdkgQoXy5ADqDBxqP%2BcBWucd0pWeGDekL2icIUqT6LS4gmj179hsCOuR6NyAMmawJ68TRwRJI5cblNTDeA%2Bswd6rkKxNstRWLeD%2FUn%2Fj1119%2F%2BVcjyHXIBPQwCToAN3DrH%2BpPiIt4%2F5%2B9c4Fr4tgef8BnLLda%2FfGTViq21VZpqVqtQICIgFGwv0qrSK310culYuu9FRBtFSq2WLEiXgSfYH1A0JKqQKIi2iJqgmh9oGDFFy%2B1FEXCLXrp7%2FHff%2BHo6bC72WxCggnufOYDs7Ozm8nszM43Z86ckxSnXyYE95wyyUGtlFwqXgSXXypepFZK%2BNScBB2oOdyBCTqNjY0AImqlxISg06KdppScPx4Gw6T87DdqpWRm0ADcZC6YSOZgGtZTVgw6GzduBNDp90x36Nlhs5%2FXqNyQRVot%2BLlNeYtL2skEHdxdBUIdoB%2FAF5Sa3Li0%2Fdfb5%2B7WXfn19rlLp78gz%2FIEHaQcsEVBzvSGpjUaTZ7iLY3KHTfAA3XBiriLs0Nh4RFyUszIyPjbo%2FD3v%2F%2F94MGD5Fkzpevr61evXs38anPnzv2qbVhm%2FeHLL78kv9Nnn33G%2FOKxsbE%2F%2FfSTmVqbvG1VVVUMEVJTU2nrjKmpqXD%2BveBAcGDEnHvInNLTCe0End8aq%2BFldLv6ePGh8Y13zyBhQILDhgqAjpOj%2BPXXXhxnYHB3b%2FlBTwOdtWviyJ1Eh%2FJylcrsJ0SiAy5UoUlraiqDg2T%2BMlfw54Dmqlv3vkmqr8phsr92IVGtknC%2FVMneAqDzm7YKLi8%2B1CLUIQsw0wg6w4bYgTwGrm24W6ZWStISX2dewpozM2iAWvlnzSsubVErJbj4Raof0S4nQQc%2BGv6ygs7t6uNAYyYEHUC08rPfwDC5cWkHgA6q6QgmkllphiPTikHH09MTQAd%2Fe%2Fn72P8hwinO871dffzmjYOwjEVT0%2FGXufrLXLGXk6ATE%2FGSRuVWWhTRqmsWo1G55ex44xHouDFphiOHe%2BmKpByTgM7aFd4alXvJ8bm3q4%2BDgeacHaNw9ErcXsGZ7%2BjRo48g58%2F%2FBsl1Ll269P7770%2BcOHHRokVXr17FO3MnqqurmZN9QEDAli1b5E9ACAxksQrfMYiZkJBAcE5LMjU1FR9Wbm4unn11aH8%2BoJMlj20n6NRWq%2BCnwsk8P7XKfXVcEDrUhAQOT%2BzDmIBZ%2BbVXnRi2F3hluLmOpIEObLOikVZgYCC%2BVfCjMdFplq7wG3EkWve%2BSYoPye7WFv968wdYxqK9VDkuj4kYrFZJLp1adLe2uPzsl3xWvhB0nBzFmRtHAqw03C2D1auwWQM5Po48JXXr%2B4cIpzhP9mvNDyANUislUHNF1k7UAyMvgTSCDmrncIDO3V%2BvmBx0Rg%2FvrVZKTh4cX3Mjr%2BZG3smD47HmgolkDprhOGXFoNO7d2%2BRSNS9my3ZU%2BOXvgx8A3%2FDZj9PnkU9O4qi4GVKgs6wIXYE1rSoM0vd%2B7bNeajty4E4eiU6NMoxCeiM93mVXGLTqNxpEtpz507D3BYbG%2Fsn4DxKkTMfToGsiQcPHpSWlgYGBkql0mXLlgmgwxPSHhfolJeXI8dgIi4uDh9uXFwc5kdFRdbX1%2BtdujKhMrJa5V6g%2BhtTR6exUYtLS%2BT4RR0dVmjmmUnbdUXeH5Zs1q9PekJ2XZHfnSP9UB1Y1aJQrFa1rKFwFKadan2ptqxeYeT%2BEUizjAyLOEASaqUkc6MB6kFOjuKIsBfwWrVSEhH2AlTvUF6uqUDnXv1tk4OOk6MYxFFY%2BZjwh4pNvZ9%2BqKYjmEjmwBrmKWsFnRMnToA4p%2FfTXWlDy9%2FHPn7pyzERLzF%2FdiDooCc2EnRgC2XY7OfXrRgWGTYIln7il76clvgaEV3SEvVH5kdDJZmUYxLQ8XAbOmyI3aygAetWOEeGvcD8dFy9WrVq1SO8%2BfP%2FunXrcObjTjx48ODmzZsbNmxISEjYvXs3bRGE41pBosOchlklOndaw%2B3q0ju%2FlN%2BuLq29eenXW5fqbl%2Buu3259ualW1UX79y5U1dXx9HU5KmSkhLkGDKh1WqhGJm5ZMmS6OjoDgCdI3lpMRGDYSMV%2FHwHBVj4S5O40EY3SHSYjck%2FRxfouDg7gGfK6e%2B9K4AOrdn9fexXLh0aEzGY%2BW6hlWQeDhtiFzZ7YNKKVyPCXuCzw5yU6Dg5ikcP7x0TPjgp7lWDAAur8bDm4W1qzhN0SE1kVmXkxsZGcyxdQeWx5uSv1mf794CJ7%2BOPP2ZO50KOrhawVtCJj4%2BH5%2F1s%2Fx7Yp%2FUmAHTgdQYSHdxqQe770Hsf4wqwUo6pQIe7SnV1v8LEJpfL%2FwScRynWGZecL9uffnJAR6FQZGdn0yQ9PCU6d%2B%2Fe%2FUNgdv5sEZopoiXSV79ZWlpaVlbG84lotVoSZSCdkJCAl6ekpGCBDgMdcAMJPRZBBxwiergN7WDQUWTtRO8T4Iu7oaFBWLrifp%2BY9SwNdMzxWTxBR62UNNwtQzUdVh2di0WR5pDocHzrrl1shE3muoBGV761gg4q6HB0CDzl4uyAEYAGtk3i5gKKokgzZXihCRO6KIdpR8efRyB%2Fv5IGA1kr%2FEV0BE5sDQ0NixYtekQ4Lf9jY2PxrPkS1g46gC%2F5%2Bfn79%2B%2FPbg2QyM%2FPB6Y5ceIEpOvr62trazEfzhoEOqWlpanLBtAQBw6V6R8bBDrNzc2kFg4wTUlJCT5ocm0LQOfggZxn%2B%2FfgiEyDgXr3eHNYRoZZDTSCKYpauyYOlGY6bOmKppALEiNvb29BR4f1ZdIBmdAlamoqOVS12lkN%2FqBDqukwQQcVdEy764r729n16iISiXr37q1rUhfymS1graAD4hw%2Bnh9g2ADKkG9PknKo1mA%2B1uGgHJFIRLOj4%2BPjI5FI3HUHqVTKE3Qkbq9kMnaY37p1KzU19e%2Btgb92Dk6NxiWsHXRKS0sLCgr2799fUFAAuLN%2F%2F%2F78%2FPxTp07J5fLa2loAnZqamtra2nv37tXU1BQUFADlyOVyQ0Fn24qhrKBz8LvPDAWd5ubmU6dOgeQmJSWFucO8vLwczgLoGOECwtPTU3dvdZdKpXpBBwYg%2BZccquR73xxLV0WaQnCfDh6dYLQKoEM2e0emcQ2xrLTETKzDH3TUSgluraeBzr3626AmzF%2BiM2PmrI%2FmfTLjg5nkC5xMe3qM0dvU6AtCUNNhAo2uHKsEHVTQoXl%2BYO0i6MuGVD5gUg68ZM3BOtyUw7Sj4%2BPj4%2BXlpYt1vLy8HqOvq%2Bbm5ps3b27cuDExMTErK%2Bv27ds8uae6unrGjBkftg3z589HFLDwRHZ2tkKhALghqwqrVLW1tXK5vKCgAIrJ5fLs7Ozy8nIsGRER0farfzhr1qyCggJa68HSVWlpqWlBh%2FYprIfo62r%2F%2Fpz%2B9j04Ik2iM3HiRC8vL12sI5VKvb29OUDHxdnBX%2BYaHCTDCC42WceyXmXkr1YlbN%2B959tdioR1G4KmTSOnEEzTdHTgVQB7qsG%2FrwA6uhq%2Fw%2FLNzToGgY5aKbmg%2FrjhbhkJOqSpQJ6gs3bDlsx9Kvle5U5F9jf%2FTMEOSSb4gA5uMhfUdHRhDTPfKkEHFXTQ8wPHCATQqampRDV7XZRDtQbTso5eymHq6ADowOTh2TYA5TBBZ9CgQSDiIv9KpVLWKa09mUbvuvrll19SUlLkVh7y8%2FNPnDgBQLN%2F%2F%2F4TrQEQp76%2BHr9cQUFBTU0NbfUKz0Ji8%2BbN586doz0LBJ2Nn%2F%2BFVaIDLlT56%2BjQ7s9xiKBD%2Fh5gHVa0XVcAOl5eXlKp1K9tANfl3KDD%2FAijdXTiE5Pke5XyvcqMPbnbv9u7abt8MtuufhrogCNPJ0cxuIBQZKULoMN8KB2fY1bWMRR0AGVOHhx%2FtuCD04ffgUPaX247OtA5AXS2f7d3qzzrq%2FgEEnEgzQd0BF8QTI7Rm2OVoAMKOra2NnyGn4uzQ2jINPgLVEHpC6ZiHT6UwwE6MpmMNhLGPgpkvkajcXltcO%2Bnu9JigP84jonNuFMPHjy4dOnS5MmTJ06cuGrVquvXr%2FO8T%2BcAnXPnzmVnZ8MqVXZ2dn5rAHA5ceIELFfV1NQUFxcz9ZGhGP7lBh1WylkXKQIXqpYJOt7e3mS3DAgI8PPzA%2FUdDokOcwgbBzpB06btyNqXrsiR71Wmf5%2B7VZ6VlvFd5OLPaVUKCAgQQCcgIKCmppLZ8paWYxDrhIZM07WhJHHNV7DiiRBvHOjQyIZ2yA06O7L27VRkZ%2BzJ3XPgyFZ5Vmr67vVpO5id09NjzNa0ZFAh5Xgc4AtCUNPRyzdYwCpBB%2BQW6PmBo0PQTnHLckj%2BaT%2Fr8KQck4AO60q2Rfm66hygg5jCmsjOzi4oKFAoFKxnaZmsoHP%2F%2Fv179%2B7V1VbV3S5njbW3K%2B%2Fdu4ebw3lSJp9i7ZfoPF7Q%2BdvcsG8zFd9mfv%2BdMi87%2F%2BjGbRkbt2Usi1vJnEuYoEMxwhPiAoL2erTAQ%2F6sA1qYrF8BbUJGhodCAb2g81x%2F8Ruv9zEocoPOt5mKrZmKtIysfXk%2Frt%2B6c92Wbcmp25id8733psL6KesXwUz0BSGo6SDKcCesD3QMUtDBnsFTlkO%2B8TislpG3ZU2DvhhTV5qVfmi%2BrnDpir9ERwAdGkZY%2FiEr6PAhEjOVeYygszUtWZG1EyP8GjFUGXn6jBmbd2Ru2p6RkrZj3eZv125I%2FeemrRGL9Et0li%2BLormA2L8%2FR9h1xfpaeyyZfFgHlh0pimKtIYIOSnTKSksaG7W6BCd2T3Xp2cPWiPj5ZxEURU0LYjGDvjpp%2FcZtGclbtq1ZvzkheVPi%2Bi1fsi1d8QQdQU2HG2uYZ60PdFBBxyALOjgSSJTRm8ZfAKzjR1fmAIeeIpGIJ%2BUIEh3LhxJz1FAAHRg%2BaMOTNhh1DS6OXVdfrUpITt22dmPqmpTNa1I2J27Y8u6UqcwfzTSJDvODXnrhPymK4hj7T5QLCGb7dHyOXtbB1ztr3SLDQ0NDpkWGh0aGh7o4O4C1JJAAhYZMY73EuEywBcUKOu%2B9PwPgG0AnIWXTtPemMzsnT9BxchQL1nSYNMORI9JaWzDIgg72VxwJtPcp96GuRV%2B8LWvimT7dRCIR7RSrLAfKtF%2BiM2rkEPt%2B3Wnx7bd8zfHr%2F7fffrt1sxzib7%2F9xvMjnoSlK7khQQAd6Pwuzg5FmkIPt6Fo6So0ZJoiaydt%2BOAhB%2Bi8PXnyoqVfJG5oAZ24b9ayTiRMHR28MyZGjRzCvXwggA62VYcluFkHX%2B9Yn61pyUWawiJNIYkyJOXAm7%2BxUUsWwMuNS3CATkBAwNuTJ%2F99QeRnMbGfRi56%2B%2B3JTMoJCAjgDzpoTUcrBB4tYH2gAwo6THmJ3q4JSo7Qv%2Fn8RTcReu9MKwCaYmQmB%2BVwSHT8%2FPxkbYO3tzeoI5ODRKPRdNiuq6amph8ObV44V7Rwrijuc6fKykoBdORGhc4HOuPGjaP51eSz6wrMXJG%2FKIxTRsYRoWsKwQJ6JToC6JDvLstJc7AOE3RQbIMcw6QcmAVMyDrcoIM9kCPBH3RgThGJRCqVSisEfS1gZaBz%2FPhxAB2miys%2BAzI4SAYCTPwLXVORlY45kMDhwee2tDJM0LG1taE5HyUvYZXoMKcNmEWAdcihotFoXN98ZYBDT1qc8o4fTwrhX6ypqen40V0AOgvnigTQkRsbLBZ09u%2FPoW3fox0uXhxBei%2BH7eW6uiuwDseuKwQdD7ehoELRTtAhhwZrWgAda9l1Rb4kIa2LdXSBDkKMLsqhWgMWY36iQTkdCTro9GrevHlaIehrASsDnZUrVwLo9Lc3wMUVR2elOfXkKMn%2FFCvo2PXqousOTNDRNW0g65BvcF0uIMyx66qpqena1fPXrxRDvHPnDk9IEpau5G2DxYKOEZaRfXx8aLIc2iEf0IFJwl%2FmKoAOObrNlLaK7eWsL0xW1mGCzqG83MjwUPgFy005VGswCet0JOigPrKLi4tWCPpawMpA5%2F333wfQ4TDQzjo8yMyw2c9Hhg2Suvd1chRzg87zz%2FXkMBGr61QvcYsvEvITbW1tAHT8fewjw16YFTSAPEsDHX9%2F%2F4n6Avn660jQ4Yk1zGIC6MjbBosFHRCrjB7eO2z2wLDZA2GYkN2VZjCQ7Ip80osXL2Y69YRdMBRFYcLQXVd8PhrKZGTspCiKvL%2BH21C0yxwcJOv3TPcn0Kmnv499RNgLxnkIJ7uHEenRw3tHhL0QNmug1K3lnaw30ljH38c%2BdtFIqjUwr%2BVDOXBt%2B1mnI0HHyVHcs4ctOL3SCkFfC1gZ6Li4uIhEIp6mApmdfvTw3hqVG8Z1K4Zxg85DryI2NiJDIxvopCW6aFTuEI8oxuAUQgMd%2Fq9sKCmAjtwKgyWDjr%2BPvVrljnHl0lfIoWRa0AkOkoF%2BMfmXQz2OQxmZ58DZubMN6DC3fZ07d04kEnH8lOp8yshpia%2BrVRKImZtGjh7em3ziZk3PDBqAlvcOZ7lOmeTA5%2BOQdZoar5z54d3iPBnVGpg1R2UdKMD9t52sA6DzTmCLqUzjwpR3%2F4umCO8vcyUjaUkElg5EItGFCxe0QuBsASsDHRDnGGEqEAZPzo43NCq3i0URNdcPnj4yWaNyW7fqLVrHIodZC%2BjY2OxIfn3PtyP5x0l%2B%2F8mU6HhL%2BmpU7qePBFaWKy4WRWhU7mmJLk6OYqb3cp7vaywmgI7cCoOhoFOkzl3yjz4Qf75E9x3BFKEZmkPa0QHEuXohpXWYBKpV7gjlTo5i04KOk6MYWAc8XtXUVHK7cmw%2F6GTK0ymKeu7ZfjDSwZ1naMg0iDBXxcbGPjmgExMxWK2SnCucdbsi59KpRWqVJC3xdfI1aL706OG9gXKqr8orLm1RKyWHs1yZsMJaAZJ16m4WUK2BVnNDN6BwWB1krQMtEzqPl%2BTVN95w4XBzq%2BvU6FEjPNyGkvMRa%2F2RddBs4IYNG7RC4GwBawId1ETm48uT1gXhUKNyO31kMjTIrapjGpXbkX3BZMeiXQWgk%2F%2FdaBQC8Umwgs4kv%2F%2FUqNzv1JbDp58%2BEqhRuYPmPM17ORIMz4Qu0PnjRRDy4dRz504z57y9e%2FeuWrUqNjb24MGDzLPcOadO7l%2B9fPjq5cMz0mZWVFRwF8azwtKVvG0wFHROFam2prwdvaDPwrmiK1euYMPySZSXl6empqakpKSnp1dVVdEu0Wq1CoUiLi5uyZIlV65cqb7xo1rlfrEoAjpq9fWDapV7TMRgHBqmBR14s1MUBVrJ8Psb3dLhh2Ki%2FaADysh9%2BvSB30vo6wo%2BAuqzdu3aJwd0MjeNVKskv2mrfv%2F99wf363%2F64d3DCldscLMmQJxTfVX%2Be2u4diFRrZTwFOo4OYqz0ryaH9ymKOr%2F%2Fb%2F%2FR7UGtVJCVpgVFKAkx1%2FyDgalAXQ83IYOGmjn6ekhNTA4OYppoOMvc4XNMYfycqHC5LIvqukI%2BshafcGaQGfDhg0g0THIVCD21GFD7EjQqbl%2BwDjQOX1k8tULKbeqjtXeOlNz%2FeCl0zE0%2BtEBOvYalVvtrTPwRIrz%2FKLDB4NdQTMtXeEXVyn3kHNbbGzs34iwbt068ix3Wth1JTdRMBR0rl87d%2FhAAsRbt25xPybybElJSQwR4uLiysvLsUBtbS2eHDP6ZYqiLpcdVqvczx%2BfCx31%2BqXtapV7RNgL2J1MCzrAN6Eh02CS8Je5KrLaLC3h50LCVKDzwiB7kUjUS9ylsVFbU1O5fFkUxLVr4iiKeqJAB9atGu6WAW3AAhat2c10OGWSg1opqbi0BT76UvEitVLi72NP%2Bzi0sURLbFsnOfPDu8A6VGuggQ5zXRKKcfxVZKXTPp3%2FIYKOxH00TR%2Bfz6GnpxsNdAB9wFZ4TU0lynKwSmg2UCsEzhawJtBBTWR8zIYm0hJf06jczh%2F%2FCOkkZlHL4u7yZVGst2JKdK5eSGG2Z%2B2tM7AQBsTDCjpjRraoBxXn%2BV4%2Bu%2Br0kcD18a%2BKbGzAGpC5QcfF2QEnNrlcTkDOwyR%2FuU5TU9NJ9d5tm2ZCrK6%2BhnfmTggSHXnbYCjocDcvx1nkGEykpqZi%2BfT0dMhfvDjKU%2BJCUdTxwv2Zm0YA61wsioBlLHI1wRygExkeCj%2B%2B%2FWWu8OOVVBYmx2b7QQeVkUGeWlFRQTHCggULnhyJTotYRSUpPiS7diHxpx%2FeVaskK5cOJdvcfOlhQ%2Bz%2BIJviPNml4kVAOTRSgZVNxvPRmcGseXCQrEhTWFZaQkYQHFbcKG1qvELGXfIN7fmyADrvvjNJ32YSneffC55CzkckqEH9izSF5NAQzAZq%2BQVrAh3QRDbCVCD23WFD7IB1gEjCZj%2BvXxnZxgaXrm5c2qarVevv3kTWYQUdu15dYiJegs9tkeU8ohymwUCeK1ZYTNfSFX5rJ0dxYeERmNto4hwgHYOEOjhHGpQQQEfeNnQM6JSXlyPfkAl0C0pmRi2MLCkpOZSXK3XvC6wDlDPlrTb6oaYFHQ%2B3oTU1lVRrKCstiQwPpSiqSFNI9l4y3X7QIZWR%2Bz3Tfc6cOXPn%2FpXU9zx4IGfQoEEDHHqSn0umO58y8sqlQ1EZmabmQn5xc6SnTHI4nOWK%2BshMcQ452UM%2F0fWXQ4edVnNw6tk6HbyOHx0T%2Fuf6LK08z0MAHVYXEPi65k7QDAZGhoeCDhn%2Bpcl1Hm6XEfSRtXqCNYEOrFsZZyqQ7KlS9744nPiDDir36GpRUPr5Y3VMF%2Bg4OYqHDbHzcnuG5gnL3BIdJ0cxauqsWrWKKdEhf%2BIbhC%2F8CwugI28bHi%2Fo4IMjQWfJkiXR0dGwvXzYEDtymJDDx7SgAyYeDuXlwpJB69IV19pB%2B0EHlJEdn%2FtTGbmw8Ch%2BQdTR4VAE7Hyg4%2BQoHj2895RJDqToDtvE3IlhQ%2Bz8fezxnWzox0HNeW5Nh5uT3sulbi3TwbAhdoZ%2BLrO8yUGHqWPU2KglF7DQbKCgj6xrXoZ8qwEd1ETu90x3Zg8zOoc%2F6HCIc6ApUajDATqsviA6AHRwYjt48CATdE6dOoUFzJQQQKct58gNBZ2a6muawlSI1dVXeT4mrVYbFxdH0kxMTExKSgperlAo8CwJOhwDyuSgw%2FFZzFPtBx1URoY3SWOjtqCgwMlRvHZNXHCQDEGnaxcb5qdDTqcEHV1ftlPmk6DD%2FII9e9ja2toYEaOiwnV5L%2BcW5OBZmkQHuF%2BRlQ5qOhRFoQN2qLagj8zNN3jWakCnnZrIzN4MOfxBB%2FWIse2YiZLjH%2BmS6IDNQJosB%2BpAA50JEyZwa675%2BfnhwAgICNC7dIXrVs3NzQ0NDevWrSNZx1BxzrUrZzWFqWdPKc6eUvzyyy84ZXInBNCRtw2Ggs6pIhV63jBo1xVTGRnXrZqbm7VabWpqKrAOgM7%2B%2FTlP23XliFFR4aQLCH9%2Ff09PTw%2FdwdPTk8Mysq6BqSvffKBDUZQiKx1AZ%2F36JFBVZq2GADqszWJFmdyg072b7XP9xcGTnzMo2tjYmhx0oElBPZ%2BiqMjwUGYjC%2FrIzImYmWM1oNN%2BTWRmF9FrGZlURsad4cxGxJyLReG6QAfW3ZgKRkw7Oj4%2BPhKJRJetBXd397Fjx%2FIBHRdnh9XfxF6%2FxrIV%2BeLFi6mpqXK53KD9O83NzejUM3pBH8Gpp7wdwVDQ%2BSF%2F%2B%2BrY4V8udlryjz6nT%2F3AjZW0s7W1tfn5%2Benp6ceOHaOdAtYpKSlJTU0F0DHCBYSXl5euHiuRSLy9vS0cdCoqKkADuqy0pEhTSFHU1rRkEL6ymuwSQIf1XWpFmXpBZ6x7P9Td4ZnQCzpBwcGfxSxbtXbdoqVfvP%2FBTPIdjmmaRCc4SIYGDxVZOyHS2lmwj4zzL0fCakAHNJE55Mm0x8%2FzkL9E51bVMY52hFNnC97nAB1WyhGJRDQ7Oj4%2BPhwzh1QqZYLOm6NeZvqjCHzblzmrtTOnqakpT5WKluv4ixYEiY68bTAUdNr54PReThoM5B47tKUrcOrJ2mOBciwcdNQnWsiGFsCnry7WEUCHu4dY%2FlnjQOdMwQdlp74oO%2FXFmYIPmPTDDTpB04Iz96ky96nke5U7Fdmbd2ROn%2FEB8g0maKDD1NGhKIrU0fljybX3013hV7RgH1mrO1gN6OiSiLR%2FUNH6DXlDUqLDurGc1rAc28uZiIb6OrSlKwAdLy8vpmtPoBwm6AwaNAjah%2FwrlUr1Tm8dVkAAHXnb0PlAx9vbG9%2FXkPDz8%2FNuDZYs0WG64D2Ul%2Bsve2gxj5V1BNAhX5LWmDYUdC4VL%2Fr999%2FJt%2F2tqmM03OEGnTXJGzP25ALobNv1fVpGVnxiEm28BAQE0EDHyVGsyNqJW65YPVTgxiu5XE7WUEiTLWAdoIOayO3fcmXQsCRBpzjPl3v1CtatdEl0nrbrSn40Ug5zezmCjkwmo42EsY8Cma%2FRaN4c9fKz%2FXvQ4juBfh3GMXo%2FSAAdedsggA45HMD%2FA3jWRMggC2Da5Do6NNABHR3S%2FiyTdc0Ck9UAACAASURBVATQwcdhpQmDQOfXmh%2FAniE5cWq12vq7N88fm4uiHW7Q2f7d3h1Z%2B9K%2Fz1H%2BcPzbTMWWHZmbtsvJ1zikaaADEh3wiwL%2Bbmm7rpwcxbjxSrCPTHtA5KF1gA5qItv3M%2BWWK72jlAQdsDRIth2Zxr3lfEAHuiauZOmS6PAHHVahVNCU8Xr5o8MKCKAjbxsE0MHRB2oxFBFg5QgLkAkAnY%2FnhRgdjxw%2BQFFUnz59YNeVXtABh3SkbrIAOuQTscY0f9ApP%2FslUA5NoqNtDfV3b548OB5Yhxt0Nm5LT03fvXlH5rbdexLXb1m7MS1p81a9oANqyNjCYGWK9ksAN155enpCrYS%2FzBawDtCZN28eLMpwWPHC3mDCBA10NCq3swXvM7dfXT4bD4tWHEtXpEQHhI3oyMK6QOf%2B%2Ffv36msh3r9%2FnycqCaAjbxuYoPNba9DVnqWlpdOnT5dKpYsWLbp8%2BbKuYkbnt19Hx7ilKzAHV6QpRLeasJOWNP9KjmjcZ0u1LxgEOjTWEUCHfCLWmOYPOuACjFWio20NVy%2Bs5wM6i5bEbPg2PWnzt2tSNickb1qTsnnh59F6QQckOmvXxIF%2FEvhJQAMdJ0cxbLwaOHAgVEn4y2wB6wCdSZMmAeiYZFCtXRMHEXfrebgNhZzgIBn5EUzQAZQ5W%2FD%2BxaLwS6djYD85STl8JDrWCzrCriu5iQINdBoaGkpbw2%2B%2F%2FcYKK50VdMDXFTnu4OWuC3Q83IYiEvFJxMXOztv3j%2FS0sE%2FnT8fyE8a7ikQikOioTxRWVFSAoKimphI2uZBLV%2FhCwDUsAXSwTaw0wRN0fjryLopzWCU6Wq229uZZPqAzefLk2K%2B%2F%2BefGNACdpcvjmJTD1NFBD%2B3Uo8DqigscQYhE1jGbax9HsI6mMeGWK5D%2BPeo2LZYzYOMV5pBic12gQyMb2iGrwUCzSnSch73US9yFFv18vVmnzPZkCk495SYKNNC5cOGCrDVUVlayPqC6urr8%2FPycnJwzZ87U19ezlmlPpkkkOjQXPr6%2BvnqVkQF01q6JAy%2FNkeGh8LNVF%2BgYNLOSjiwOK8agLwuQ9gPo7Mrcce7cOdIRUllpCQle5CcC6%2Fj5jsvOzmadqKwls6amkvxeT1qaJ%2BhcUH%2BsF3Tq797kAzrQMYLfmz77w7%2B%2BO2Wqrn5C09FxchQvXxZVVloCLkpqaipZe%2BYzfbqBIEDYeKXVEawDdOApstq0MHSIAuiEhkzzcBsKr1T4C0ZRwZUx3hNAJzjwWYjr451pTAOH%2Bd%2BNxjLBgc8%2B27%2BnSCTCmzg5im1tbYwAHV9fX7%2B2wdvbG9SRyXGi0WgGv%2FRC1y42tOjjM7Y9Mx%2FrtU1NTVWVpaUl%2BRBJ03Os5TFTWLqiARINdE6ePCltDbpAB1vSTIl2go5UKmW1cjlu3Dju7eW6PBm1H3SSVjiDr66TeX6QOKwYI3Xv6%2BQoJkGHpqNDDlvWdL9nunt7ewugw9o41pLJE3TOHZ2lF3Tqasv5gw753mZN00AHfgaA6zf4Qc5URnZyFPe37wFTpEql0jHRP%2BnZ1gQ6HN5n%2BA8wUp8LVL0UWengRxA28pG%2Fdez7dUdD4CKR6OWXngKfLLS%2F7qP6iEQismT7QcfHx4d15gDWIQeJLsvIgjIyjS0s6pAGOteuXfv666%2BTkpJqa2vNhDLct0XQUSqzu3ez5Yjh4QtIy8gTJ07URTnQgceNG8e9vRykquhWMzhItnZNHP8RraskwE3ZqS9a1hdunYXDiLAX2gk6To7idyaPF0BHV7NbRb6%2FzHX5sihdVe3ezRYMBhbnyfSCTmX59%2BYDHZoyMvjSYurooD7yypUrn3Si0fH9rQB0VCoV4Gp%2F%2Bx66uib%2FfCbooGiHag0k6JC3FYlEukgLdlFh9Zi%2FEQ2S6Pj6%2BuqiHJw5BNCRW3mggU5jY%2BP11vDgwQNuIjHTWQSdnJzsnj1sOSLTBcR4fcHf3x977OLFi0kNGEN1dMghqSstde87M2gAkA1uHThTMEOtck9a4dx%2B0BF0dHS1fOfIR9BRKyXVV%2BXIOlq2cPrwO%2BYGndCQaWB5QZcyspOjGKbISZMmsdVRyNNaAejg3vLnn%2BvJZyBFhg1KS3xt16bhYbOfZ5Zngk5oyLStackuzg4uzg5lpSX1d2tydryRlvgazZtuh4EOTgk8EyDRGTbEbuXSV3J2jEpLdIGaP0aJztWrV69du1ZXV4ezsrB0JW8baKCDDaUrUXpR87387xAvX76gq5jR%2BQg6NK%2BBzBFEs4zMs5discWLFx%2FJS0tLdMncNCIi7AUEHRdnBxDkcCsjM%2BtD5vj72APf4F9zSHQE0CHbvPOlSdApzpPhxismL1wv2w6Uo1ZKuLeXY%2F%2FnTpBLV2GzBh7eN51qG2AZi9nm3bvZikQiFxcXZiWFHK3WGkAH95Yzny4zJy3xNVKNZt2KYbQyADpFmkLwbgN%2BbWDpCni58e4ZuMMRxZuovQjI3DESHe6RwDwLoHNEMUajcsc45S0HM4HO6eKDKd9IU76RZqTNvH79OuvMmrB8%2BMK5ojPFCjwrgI68bTAUdIqNdeqJj4A70ZGgc%2FvGbgSRn08vpigqOEiGYnmjQWf08N54W12J0cN7c0h0tqYl07SSaYdAgQLo0F6qneyQBB21UvLTkXcb7pYxd12RlGNy0EmKexUQ6vyx2VfPx5VoloO2vq6mho1XvXv3FrCGtQVEDRYfPD09RSIR04UC85H7%2B9j%2Fsbv79JHJ9Xdu1tVePn1kskblBuqHWJim%2FOgvc3VxdkDoaWq8UnYqpv7OzerrBzQqt5wdb%2BCFlizR2Zzoq1G5X9REPKq5%2BxHFGG7QuXfvHvfMx3q2qamp8McMcKMdvaCPLs1ZAXTaUg3LkaGgc%2Fzod6uWDV%2B1bPjyRU4l546zPh3uTG7N8WPHji1ZsmTt2rV6JToFeV%2BTOjpM8ubOWbx48e0bu3%2B5eab%2Bzs0LRREAOkWawpqaSvi9AQkjlJFjIgYD39yqLISb03DH38f%2BmT7deom7gB9E0mAg7FisqKjYt2%2FfAh1h27ZtZaUlTo5iAXTwrdgpEzTQUSslxXmyC%2BqPK8u%2F%2F%2BXmmV9unrletv304UCU5Zh86WrDuqVqpeT04XfqasvrasvB14TUrUWPXlcEfQmRyAom9MdCHFbQLgMHDhSJRGhHWNeTdnIUh81%2BXqNyu162DZoS7PiRUhmOa50cxbs2Ddeo3Orv3ITLgZPwEksGnTzFWxqVe13t5Uc1D9So3IcNsXNxdvgiOoI2%2F128eDEqKiqkNcTHx1%2B7do1WgOOwqamp6IRi0z%2FfhlhZUc5aOPIjkSDRYaEbIstQ0GFtZ56ZCoUipjXExcUxHZiXlJTA2XnzQimK0gs6pacT2gk695vqoaNWXz9QWvQxxRZw3PFPpCW6qFXu549%2FhDcH0JkZNACXoXuJu9jY2Lz80lMvv%2FRUfPQrapX7go8GwaGNjU1FRcWcOXNsbGye69%2BTFm1sbBYsWCCADv%2FHYb0lmaBDYxrWQxMuXRXkrVQrJVdK1kNPrihXqJWSmUEDOJoUbLOJRKKSkhK4SvhLtoAVgA6oWdn16sLxmOEUSHTwTccq0eG4yboVwzQqt8ryrIaGhtqbDxewsLxIJAr94PmcHW8w48ZVr4pEIlMpIwcYGDQaDUh0gPDqai%2FDAhbWPOTDqTgj3rp1CxAH%2F86fP9846Q7ek5k4XpBZcGRnddUVPCUsXRGQ05LsMNBJT08HjsG%2FJOsg5Sxe3LIJhQ%2FotF%2Bic%2Bd2AUD5haIItco9bPZA7KsgL9ELW2R5J0exi7NDaMi0vfJPfj69%2BMq5L5taw9WS1QA6ZOFe4i4vv%2FQUTdIDh3%2Bx6wqg88brLEtgL7%2F0lAA6ZEt24jSAzp6towyKJgQdhXy5Wik5f2wuTNXgUQthnbXl0eNVRkYGOcELaWgBSwedkpISAB1d%2BjHkUx82xA6kMsV5vqBns2vTcLIAdxo4CRa%2F4HJSGvSH3ckFHw0iFYAwvSP5dQCdstKSPxywBQW9Y9D28osXzwe0I2g0mveDRgLcnD7SIsvRMCaP69ceMkdqaioiDib27NmDRGKShLY1kLdqaGi4e%2FduEI8wadKkmTNnfmt5YRuPEBsbO2nSpClTpuj9oqdPnybbx0xprVaLfIOJuLg4%2FLiEhATMnzXzPT6g035l5Ns3dqNtG7XKnTYqjdDRWbsmjmKE5ge31Sr3lUtfIe%2FPATqT%2FP6zqqoyNPTDWdMGbUr6KjVlRWv8OjXl683rvnJ6%2Fj8E0CFbshOnu3eztTE8iEQ2UVHhFEVNCwo0%2BnWOyshpia%2BrlRJ0pJWzfTR3gw9waDHeJhKJPvvsM5jahb9kC1g66CiVSnh%2BPN15DhtiF7%2F0ZUAQpiYyd19xchT7%2B9gDKh1RvDmrrahQL%2BiMGjkEXrYNDQ2BgYHkZ3FsL%2B%2FZw%2FbcuXNGD4yAgABQRm6t%2BQiNqkU7h1ZzJ0dxYeERmNuWLVuGfIOJpKQknPnMmviER5BKpQEBATwKWmIRcEcVFhamt3I%2F%2F%2FyzQU394MGDO48C%2Fy3o5eXlyDFkAvV1yMwlS5Zs3rxZrzSl%2FaBTcnrnYcUY2OwN2sHkYDECdFycHWD%2F7aLwydVX0mAYnj82Ky3Rhbyzk6P4IeicyDlRVERG9fHMw4oxNTWVMUvDDn7n%2B82KZatXxGJc%2BWXMcw59BNChNWZnPXy2f4%2F%2B9sbEZV8sNBXotO6iHapWSs788G6OfBpIOtFnEbPl0ZTOpEmTyAleSEMLWDrorFy5EkAHXWAyn3HH5ADoqH9coT4up0WQ6ADoKLLSa2oqGxoaSFcSrKDTs0eLWTaRSGQS0OFuhHPnHsoP4uPjkW8wYZBEp%2BJ6yfGCVIjkBnKDpm2OwlLrD2VlZRxf0LhTxvm6qqqqIlEG01gHUqKzZMmS6OjoDgAd0o4Os98aATrkTWDv5P59X7GK%2BgF0Tpy8cOJ0bZt4IuebL4ZWVVV%2Bvnju19Gv%2B7cNEyZMsP8POwF0yHbu3GkwdgCeSdAT4to1ceCBAWxaos9EtOAHOwdNItGB5kVryGA5kFvgCq49XVxcBLhhtoClgw7uLedpRMd8w8%2FW1iY48Fn1iewTp39pE09dWx%2FvLBKJ3hz1MkVRy5dFeXmOrqioaGzUIuuwgg4AXL9nutO8lwcYGDQazdBXXuSw8DZmzEic2C5evIh8g4lbt25hAe4EOvWM%2B9wp7nMnXbuuuG%2FCfXaX9Ye7d%2B9yf0cjzhoHOs3NzSkpKcg3kFAo%2Ftz2f%2BzYMTxrNOjQXFwxDzkMBnq4DUWHmpAAt5oG7bqCqWhrWvLWtGQwdE6OPvKdAKCTLt%2Bduk1JxvQdK1FHx6F%2Fb%2BCc7a1h9uzZAuiQbfgkpAFZQDSIe3LhMDRkGmwMhEMwUAJtYnLQAb6BncI1NZVQE%2BQq2oOAvYS9e%2FdmTvNCjqWDjmn9ltN6hkGH3bvZDnnpqSOHM5X5F9rEvCLw4unhNhRA52m7riNGjIDB0Nio9Ze56gId0LCmgY6fn58XZxg7dizJQhqN5uUhL%2Bqy2T9yxHCaV4GjR48i4oSEhFy4YID1uaampiOHtoWHiiDeuHHDiDlbuMSIFqivr%2F9jjfLw4cOXL7fsreN%2FB61WS7JOeno67drc3FxgHQCdnJxsmtM02iHTBYSHh4e77uDp6cnhAsJf5lqkKaSZq9FlFU3XgAUhEE48kIAdUrRLeom7PNe%2Fp6urK%2FiMw7%2BB%2FzUGd1099dRT%2Fv7%2BsbGxUVFRH3%2F88fr16wXQoTXjk3AIkOEvc4WEh9tQgHLwh9jYqF2%2BLOpQXi7pSsJMoIO7BOD%2BukCnl7gL%2FHgWsIbZApYOOib0W97OwdniIdbGJvC%2F3qQtrcjGez3bv2fPHrZgj8df5gomDeANDgsBukAHNmrRQMfHx8fT01PXxCGRSJig4%2BE2lPntJo4fgytWtLnt3r17F1oDLd9Uh1VVVdXV1eZY2DJVDZ%2B0%2B1RVVZWXl6NqDu3ra7Xa%2FPx8BB27Xl044uLFEeT28okTJ3p5eeliHU9PT26nnsx%2Ba0SOi7MDuD1XZKVDQtfqGEwGwcHBiDiQ8PDwEIlEa9euHTFiBICOv79%2FVGvw9%2FefMGFCz549fcZ5g%2B1mwY6OEc%2FI6i4BevZwGwqgA%2FUvKy0B0EGqJmWHJgcdMG8Ln4Ua96xveydHMZrSEXaYWx%2Fo9O7dm6cRHXMPpBbQEYkkHh400JFIJFhDtEa4b98%2BiqJwDBgKOl5eXqysA5TDE3S4DQbSpjrTHka02tE5cTTVtLcV7ma%2BFjDaMjKADvRYpiDSuzVwSHRMMmxx3OH0Qy4o0D7CX%2BbKBJ2lS5fiYtngF%2Fr6%2B%2FvPnj37wIEDhYWFU6dOnTBhwkuD%2BuB9BNDBpujECRroKLJ2AvGUlZaAfcvI8FDQoUEBpMlBx8lRDOC%2BfFmUi7NDkaZQlzjHyVHc75nuINERQMf6QAeeHB8jOuYecs8%2F1%2FP553ouWbKEBjoBAQFBU2RgzAPesxcvngfKqamp5F660iXRgQlj%2FPjxbXUi%2FfFnaAARYNcV8%2BsLoGM%2BLDDtnWtqajSFqRBvXDdsN5apatJ%2B0PH29iZ6ZUvSz8%2BvY0AHZqDgIFlZaQlFUaj3wxwULTsr%2BYFOVFTU9u3bY2Njv%2FnmGwF0WFuyU2Z6uA09lJfr4TaUBjrwbm9s1Lo4OyxfFgWyPVhUMh%2FouDg70MgG9T6Zjd%2FfvgdMl0qlskEIbVvA0peu4Mn1fror87k%2BlhxW0AFVfNTR%2Ba%2B3%2FCiKAtck4MfHCImOl5eXTCZrmS6IYAmgw2efc8RHougFfWgSnfr6%2BksX8yFWVrAoBtXV1R06dCg7Ozs%2FP5%2FnsldjY2N15UW4589lx%2B7fv2%2Bqid%2Fo%2B9TV1WVnZ%2Bfk5Jw9e7aurq6ysjKnNdTV1f3222%2Bsty0rPQteNVrMSZ8uYC1j7sxOADp%2FOLECZ1VOjmKwaMX6iuAJOiDUmT17NixdCRId1sbsfJmo%2BQtk4%2BLsQC5dwfeFnX3QxyiKUmSlQz5IdAInT%2FQZJzUuTnn3LVD0hBsCbOH2Lm5lZDSls2HDhgYhtG0BiwYdtBbI04hOB4w6vaBTpCl83vE%2FYmNj0YVWcJCs04DOgwcPSktLAwMDpVLpsmXLrl69yjoBH2u1jHzj2nnybEVFBU7nx4%2FuampqIs82NzeXlpaGhIRIpdJFixZdunSJdpb18Ndff01e5Qu33bR28p07d1iLdVhmY2NjaWkpyPxSU1NLS0v37NkDh6dOnaqvr2etyU%2BnfkxLfnv18uFL%2FtHnxyNZrGXMnWnVoAPqC7gxHg7xdzbttcATdD7%2B%2BOPVq1dzSHTQJuT48ePfDfS3%2FDh%2B%2FHisc01NJa1ZhENsAdSMAWnK1rRkWnPBKhKQENnNAHQgvz1%2FUcEZGIt2K5qMB6uNpnTmzZvXdpYXjhosGnTQWuBjN6IDHo%2F72%2FdgBR3fcW8%2B278Hks1fP5wjEonglwEMgycNdBpbA21urqqqkm%2BdGfe5U%2BRHoqNH0llBBwzuzZ8%2Fnz%2FobNs0O%2BHL4dGf9lmfILMQ0PFsDQg6cMgBOrSGeiyHjxF0XJwdYEsL%2BRdf3zwTYL8KCiuydrJuuYKz2TtGBb4tReEoJGa%2FL8neMcrDbegzfbr1feYvIM7Zvn27QqH4%2BOOPJ0yY0K%2FvU72f7gpzDMxzRZrCIk3hvLC%2F2tjYsPqU0JmpdFezRAmrByVTZUaHD%2BnTp8%2BhvFyoNq688GxeoRifFmjdopWuyGpvRHUxXD6DoREaMg1WZnVVxtbWRiQSvf%2F%2B%2BwLa0FrAokEnIyMDlq4sAXRg15Xzq68ydXRENjZdu9o8bdfV8bl%2B27Zt8xnnPWLECFjKBQ35zgQ69fX1hw8fPnLkyJUrVxobG%2FnPyuTCzb%2F%2B9S%2F%2BF3KUJO9DpjkuEU6xtsDjAh1Q56T9ZgVNCF1vc4582PHLUWDYEDu1yn3O7CmBgVPJuCTqXbCMPGfOHNh1Nbs1TJ06FezoiMViNBhI3r%2FfM90NAB0WviGhx4ysEx0%2BhOaXhvwWQrpztADYDBSMI9Mop6HBsiU6aBb5sVsLdHIUA%2BjMC%2FGkgY5EInnj9ZatYS2mkxcswFc2%2FHiiKIrDjk5nVUZmnUqFTEtuAZOAzvi2wdfXV68yMqp2giICDB9yOcCgGQiUJzguAdBhtYyMoAMGA2NjY6dOnbp%2B%2FXpQRiYtI5P3NwB09FAOEI%2B5WEcAHfKpddY02AwUjCNbGeigWWRL6JcAOqyWkTUqt2FD7FycHSiKKistiQwPRWOaRZpC0BF72u5PfWr7fg%2F3AXKAjlQq9WUEHx8fkLQHEMECd11Z8owu1I21BUjQgQ2Guv4u%2B2Ih047O2LFjGb21JcPHx4e%2FHR1QceBYddL7HjAh6EydOnX79u3r16%2BH7eXtAh1eiGNe0Y4AOno7TycoIBhHZiIO5Fj00pXlmEVGiQ4H6OCuKydHMSymwg9TcGhlEOiwUg5MJMA6BOc8dOrJHKWPcXs561QqZLanBbRa7e1b5RB12f1rz%2F0RdPbt2wfiSV1%2FFyxYQAMdXZSDPZbbjk6LdnCQLDhIBqOGoiiOPbTMfk7m8AQddX4oPR6cTEp0Zs2cMZuIM2dMJ516kp8IEh0bHuEvdl0zN47gEzV5M%2Fbt28fjloYVEZauyAfXKdN2vQTjyOyoY9GgA2aRbW1tTN4pmT6T9X7EQ4nO4U9b%2FHqS8YclINEB0AHbrKAtvzUtOTT0Q5gw%2BINOW%2FE%2Fy5Gfnx8NdAa%2F9ALNTn%2FXLjbe3mPbM%2FPpuvb69etffPHF%2FPnzk5KSqqqqdBUT8k3bAsVFqoVzWzbtRy%2Foc%2FnnNtvZTPJBCDpKZXa%2FZ7r3e6b7wAHioUPsIE3%2BXbokkgQdf39%2FpnMrWg6HrytWW39G6%2BjwBR2VO1NTGEFn8IvPpq1P3LphLcbNyaufH9CPVUfn2f49yMbRle7Zw5b%2Fewx2%2FQwaNEjX3Zj5E8bZL10wOHrB4FGv92aexRy9b7kns4AR04GpGmrYELv23IpWcwSdysoWx9JCwBawaNAZOHCgSCTq2sWUoLNy6csalZtG5XZE8eaUtxz4dzIAHbiW%2BXfYEDsAHdTRwcToUSNFIhF%2F0AkwMIBTz17iLrQoG%2B9tkimQvAnP7eXkJULaJC1wvCATN%2BeXXjxjknuSN0HQgU3aSSucAQVydoyiuQFfviyKBB0De2vA4sWLSf8MrXZKWvw2wILvobxcRVY6GKbiPzaxZGR4KHlzzMcE6OgwKUetckfQeeP13tk7x2dtnaBojVlbJ%2Bzd7vPyS0%2Bxgg7emTth16sLf9BxchQ7PtePf%2FnMjSPJzVlJca9yV0Y4iy2wculQaLrDWa5TJtGnA7A%2FCW9yGBf4VocEU%2FQIPZn7L3y6v489fjTHIwPLyLBX7lBeLg4N1pq3TFKtQTCOjIgDCYsGHXhmPXvYYr9sZ2LdimHAKOePfwSsI3Xvy%2FOeADr5341mRql7X1tbG1tbmxEjRoD2Jf6d8s54J0exuUGH1fuJOZauHjx4cP369cjIyE8%2B%2BWTLli03b94kJ0shbb4WqKq8dLW8GKJZl64O5eVmbhqhVrmfPhJ4pmAGEAD5w9G0oAMSneAg2dlzP%2BEsghbYeI5N%2FsWGDbGLCHuBNYbNHlhTUzlnzpyXX3oqOnwwCUPR4YOf69%2BzI0GHPxglxb0K8%2BW5o7POHZ0F6bBZA%2Fm3yRNbEpvugvpjtVJyOMtV6tZmOmhs1II9QJAUguYleBEHIsd94NCGPO3oBAfJRg%2FvDU%2FqTMEHJw%2BOVyslK5ey%2BCuExdzGRi1EMLjv4TY0JnwwXH7%2B2FxIwK8R1P4UjCNbH%2Bj0Encx1VAEyoEmqL5%2BQKNyW7diGM%2BbA%2BiIbGxYo62tDc0P4jN9uuGdHwvoTBw%2FprDwCOvUe%2BvWrYMHDx49evTWrVusBYTMTtYC5eXlxcXFupYaq6qqFArFkiVLFArF8cL9QDkwTK5cSFGr3MNm%2FzlxmhZ04FWuyEoH71ToxoE2heBQ0pVwcXYgI%2FwC1lVYVz6Ajkgk%2Botd15lBAzDCLy7LBB2Y5y6fWd7c3Hy%2F6S6wTlri67q%2Bo5CPLQBN93tr%2BLXmB7VSQpOsNDZqQTUeNpoA7tTUVAKRM3EcQCdq4T%2F%2BFjKHI0rc35ge5PFZuF9szEfx8fEr4mI%2BC%2Ff7R9g4ifsbo0e1mY9oRpnh%2Fv4yV6h5%2FZ2bDQ0N1dcPYs0RdDIyMmgz%2FRN%2BaAUSHVM5uho2xE6jcjtb8NCY0i83z2hUbmmJr2G%2F504827%2BHfb%2FuuiK3pZ%2FHAjrwdSRur9B8mGdkZIQ8CvPnzy8uLu5kk7rwdcgWqKqqiouLi3kUUlPpnlZTU1Ph5HvBgRRFXS47rFa5X9BEwJvxVuUxtco9IuwFHB3mAB0wjAYGYSFtEOjAJSgQggTNmi3WHxJg7ramphIiLEyQSxW0u8Gh0fve%2BUtooHr8y8OcV1v9Azz0y2eWq5WSzI0jad9XOKS1QMsiplJy7uis5ubm33%2F%2F%2FTdtlVopoQEigg76tIJucCgvF7pKZHgoeVsAkWlBgQHGBk%2BPMeQNAXRAVT84SAb9HEDn9OFAGKH1d25izZ%2Ft%2F9DdleAFAhoH%2F1ou6FRWVsIPKRM6utq1abhG5Xa9bNsvN8%2FA6lXY7OfJjmWm9GMEHSdH8buT3XHmKy4ufgQ5D%2F%2FPnz%2F%2F2rVrWEBIdLIWSEhIeAQ5D%2F%2Bnp6fjd8zNzcWzrw7tT1EUSHRO5vlVlCt%2BuXkGVq9IbTZzgA4uCrg4O8B6gUGggxrNaJS2sVHLATrgIwJ%2FmkMCXDn6y1w9JKNGjBgBsqVDebmR4aHnzp3bvz%2FHX%2BZqUK3Ilwl%2FcIGr%2BJcHBZ1zR2fdu1NaW90iltC1DkLWR0g7OYqh6aqvyO%2FdKb1wYp5aKaEt%2BdFA51Be7ta0ZNATAEOX5gYdVoL3l7lCza%2BXbW%2BZyFpXr2LCBzs5itHd1cqVK3GOFxIWbTAQHV2Ra0DtHJ9T3nIg9Yh3bRrezhvyf1MaAwAAIABJREFUvPzxgo6ToxiFOklJSTTQCQkJycjIwJlPb6KyovSnkwqId%2B%2Fe1VteKPAYW6C8vBw5BhNxcXFYJVLYE7Uwsr6%2B%2FlBe7sygAaSGSlqiC9nPTQs6yCjwWxne7KhxSX4udzo4SIYegpwcxbBZXdclwFXo%2BxPoCu332PXq0rdvH%2BAtUq6DvrR03ZYjnz%2B4wE34l58yyQHghvxL6lRx1OoJP4XqwNB0TDEYgI6%2FzBUWWKHbHMrL9Ze5AiubG3SAtkNDpkEEhX0nRzGt5oezXOFRCu6udFGd5Up0jh07BhId03r09Pexj4l4ad2KYZFhgzpsnD920EFlnfj4eCboJCUl4czHnWhqavrh0OaFc0UJXw6P%2B9ypsrKSu7xw9vG2QElJCfINmUB1ZjJzyZIl0dHRMJ37%2B9ivXPpK0grnmUEDaMPEtKDj5ChGF1eoZEP7RJMfwozl4TYU1q2cHMXkb3e7Xl3mzJlDURRseKEoKjAwsKCggKIoo2vCH1zgIwwqPzNowOGsh3obOdtH0zRqja7zk3Ch1K1vTPjgpLhXycVZ%2FOIo8wPe9Ze5kurGSMZY3kxLV3h%2FsDsADtd01RwmTcGvJ414LBd00KMnmA%2FGh22NiccOOnV1v8KMSyroIPEcOHCA53zc1NR0%2FGhm5EciiBUVFTwv5C5292G4%2BSjRCf7fvHu35etwf3Fzn9VqtSTKQJqU6KSkpGABEnQ4RpnJQYfjs8x0Ct1TgwY0KJnir3MEHdSKGDRo0LZt27hBB3EN60zm2PXq8uKLgzAHlsCyt49ievcMmzXQxdnB8bl%2Bffv2cXF2SIpzZpahydicHMXDhtjNDBoQNmugQDnY%2Fu1PBAfJcKM47mzFTOb9zQc6RZrCtWviSNBhfjrkAOgIfj3poHPPUgOCDreer67nbVH55gadQYMGQf9m%2FTtz5kycUO%2FduxcVFYWIExISEhUVhWcfV4LmPqwzHT52XW%2BFQoEoA4mSkhJ80OTaFoDOwQM5z%2FbvwRFjoukGA8fpCxwGA8lxasSKFXl5i0i%2FdU2Blsl6CKsA4MQ7MjyUNIhi16uLt7c3RVH4g76iogJ29rLeyslRDEqj8LsfNuMAPMFVwUGy73bvJFfBQKkZQefQ3in7cjYqFKtjP7Ff%2Fblk3VdTMH614IXYT%2Bz35Wzcl7Phx5y3AXpooDNsiF329tG4dJWW%2BLqwdKXrSfHJ72%2FPte9E134U%2B37dY6IjKYoyuTIy7Pk6lJcLIAUSHV1fBP16WurE%2FnjqJXo8H8vjU9F1%2BQCHnroeqrXkGwQ6Pj4%2B7pxBKpUGEEGj0bi8NviZPt2Y0eXVl7ZuTcNZDRLXrl1DTR3%2Bi1a0m5j2UCqVBgUF%2FbH%2F%2BcMPP%2BxMlCOVSouLj5m2rQy9m1arPXbsGKgkJyQkkJQDtyovLwe5DoCOES4gPD09OTqsVCrldgEBoxg3mLRnUANekNSi625Qsqy0BH6p19RU4o4qWDaKDA8F4yVr18Q1NDRUVVXq0kQGNaOy0pLly6LgtqBpBDNTTU1lY6PWQzJqwYIFy5dFwUZ6WPVA0Nnz%2FfIDBeo9uXs%2BebcbazxwVL2%2F4MT%2BPX9lBR2ScgB3aLuHdDWCkM%2FaAt272RrmXONR6aiocHOADonI4CWatdqQCaDj6enJY459gopYLuisX78e5BOP0XX5sCF2%2Fj72hkamEUJDQcfLy0vXzOHl5TV27FiCczqDryupVDp%2F%2Fvzm5ua1a9d2OtDJNxRNHkt5tIy8f39Of%2FseHJEm0Zk4caKXl5cu1pFKpXycegYHyUB8snxZlHFyHQ%2B3oWvXxOH%2BKVIxmTkrAFSRrEPT0bG1tQE90CJNoYfbUJFIFBT0DpIQ7YYAOkBXLs4OkeGhLs4OCFtQJYAn2KpDURR8R5OATqsysrtaKbl1I%2Bd%2B091bN3KAdYQ1LNpj4n%2FYvZvtG6%2F33rN1lEHRxsbG5KADEsq1a%2BIwcuwlhC8IrhVdXFyeIIrh8VUtF3S%2B%2Fvrrxw46tF1a5I4tjnT80pdpg8oI0PHy8vLw8PBsG4ByOiXoSKXSzifOaZXomMZM0a%2B11WUX8iHW1taYHIYQdPTuLaLp6ADoeHl5MT3Rjhs3DkyEc0t0mNZrUF2GNo44DoFayN%2B%2BHDfBXVewm6astIQGOi%2B%2BOAhvVVZawq2jQ4IOrYZobcWuV5c33hgB90SSMwB0CnRKdMJmDQQxD3SJ%2B013AXSYWuS0ugmHulqgezfbse79cCmQZ8IcoEOrIR8dHXBgLoAODX4sF3TCwsIAdGgPuyMPHy%2FoyGQyUnITEBAw9lEg8zUaDSrKkY1jDhcQ%2F%2FrXv47kbY74SATRVLuuOpkUh%2Fw6ptLRAaeesN%2FNrE49jQYdb29vslsGBAT4%2BfnxAR1SNRhQgLU%2Fk32bmQZkIemEWQZzAHSCpsgGOPTEC3ETDamMDGfPnTvHseuKBjooy0HKadlZJhlFoxwnR7FJQOeRRMf9zi8nm5ubq6%2FIBYkOPmjjEqygU1YcdbPy2K%2B%2F%2FHy75qeqawfO%2FPgBDYAsCnQGDhxIm%2Bmf8EMBdMQcg0EX6JwpeL%2FsVPT546GnD09minZMJdGxQNBp3XW1a%2F1qafSCPgvnigTQIZmGNW0q0Olgp54cg0KXRMdo0HFyFJOsw61ryVExJrKwFn62f4%2FRo0ZSFNViRkwk6tnD9sPZQRRFMUEHkAVvq2vXFSxIgWlBECz5y1yBciDTX%2BYK%2BSjLgYqZBHSGDbHLoe%2FekuRsH8363YVMPi1AA53iPNm%2FGlrsaNBYoeJyFsk6FgU6vXv3ptX2CT%2B0XNCZPn26BUp0rpV9S%2FaYO3XVNyuO0nCnc4POz6XHjv2YCvHevXsmWUNhRYTOkWkq0Ll9u%2BpefS3ExsZGkzQ7eZP2L121B3SAdcpKS4ymHJjAgoNkTA9E5NwGpmOf699z2%2FrAS2c3ffH5uyNHjrS1tQn%2FNBQ%2F2q5XlxEjWpaZWpSI3VpcLSLr6NoYASIikNkostJJaytwHwAdsiakREf1%2FYfpmclbNn%2BxcM4zf58x4MtIX4x%2FnzEgcs4z6ZnJO%2BXr8hQTWZWRpW59SdbJ2T5q2BA72mcJh%2FxbgAY695seGokg3%2FyQJlnHHKBD60jQwbCjsn6jXuIuIpFIAB3aw7Jc0Jk0aZKlgc7NiqO05oPDO3XVJOt0YtAhp0YTpjsH07B%2BC1OBjglbm%2FVWjx10WN%2FaJs%2Fs2sXmuf49iw%2BN%2F5%2F%2F%2Fg2mjYaGBjAPiGt2Le57RSLfcW%2BSzPSHdGfbtm3du9nqYh1%2FmSv4JHJyFLs4O6B%2FouAgmYfbUMfn%2Br34It1CKUp0AF%2Fg76L5LuiGwl%2Fmyt%2BOzpRJDmGzBk6Z5GDyRnvSbkiCDjoRY0p04OWPa1jmAJ3gIBm4p8W%2FZJ9kfS4AOiKR5c7srHOouTMttzk8PT0tCnSqru3neBg3K47iGpYAOqxTKUcmKyJ0jkwBdPjsumJ9ZZsjUyQSRYcPrv%2BlkKKoBw8e3L9%2FH3CH3LX7%2FHM9bW1tIiNbtgqjIZwiTSEsdXGwDkeFDbJ07OQo1lUeVY8PZ41JinPm%2BEThlNEtQIIO%2BdZiff9XXTsAC1jmAB0jvoJdrxaJjgA6tIclgA5fHR1awzEPzx8PBdYxFej4%2BfnJ2oZHusidcHt558Aa5rd4ckDHx8fHt23w8fHRpYy8fFnUobxc7rg1LZnPi16RtZP7PofyckE5Bnw7p8S%2FCqBz7969O3XVzQ9uUxQ1YsQI8rPemTyeoqiKior9%2B3OQhIo0hfb9uotEIiNYRxe4kB9KplnLx4QPJmU%2FaqU7zXIgeQchzdECiqydjY1aXQUQdC6o5%2BkFnV9v%2F2yZoFNRUcGcpJ7YHEsHHVtbG13d0ST5oSHTOExuoDLyBU243i5SdW2%2FCUFn3LhxbWeNh0fAOuT2lo7cddXc3Fx2USPfOhPi9Wtl5IvA6DSTDzpNjqlA5%2FLly59%2B%2BunUqVPj4uKuXr1qdFPruhCXrg4eyOn3THeO%2BPlnEV9%2B%2BSX2QNherqu7Auswt5ej0WHECGYCtYM5RjpapmFeTubAVnNweRgy43kAnaampl%2Bqj%2FzPf%2F9WUVHxt5APSdUHUI4eMWJE9262mzetoygKjegYxzqs4MLxvVjLA%2BVcUM%2B788vJikub4FBYq%2BJoRl2nDuXlmgp07tTVCKCjd3J87AWedNBBr36sQwJB5%2Bcz8XofFa5etV%2Bio2vaANihaX1qNBrXN18Z4NCTFt8J9NM1qxmd39TUVPhjBmy5EnZd8aExU4FOaWnp9OnTpVLpokWLLl%2B%2BbPQT1HUhgo4RlpGZshwao7OCTllpiZ%2Bfj9HR%2BZVnwecDRVGxyz7neZ9x48b911t%2Bc9oGQCJEGdwFNuP9KWhBp0VvplUx2clRbATrsIIL6zsHMpnlWx1Wu6uV7rADqLm5%2Bacj76iV7jHhgznuI5xibQGeoHPu6CxyvLBOATcrCg0CnaBpwfgjgZnw9BjDWmH%2BmU%2FbdYWlK0GiQz4vSwedrl0MluiMHt47bPbzs4IG8HH4wgQdqXvfyLBB%2Fj72To5iBJ2yU9Fkq7GmTQU6E3kEcoRoNBpWX1dSqZQcpSZJNzU1Hcnbkrru7dR1byevkt64ccMkt%2BVDDFZaxlSgU1VVlZycvHz58l27dt2%2BfdskzU7eBEHn4IHc55%2FryRFp28vJrsgnvXjx4q1pyfV3a8pKS%2FiU11VmyttDWgyXy1wpivrqyy90FdObHxQU5Ob6BinOQdAhZUKgrIPzjaGswwQXvBVrglle6tYXRDhgL6e5uRkOWd1us95TyMQW4Ak6aqXk3p1SHCasr%2F2fz6ziCTpffPV15r798r3KrfKs2BXxrD2TBJ2WiWzWwJlBAwwyci2ADutj6mygMytoACoFH1G8OeUtPXsQaKCTlvgaXr5r0%2FCw2c%2FD4ZmC91mbj8z8%2BUy8SZauWAcAR6ZGoxk5YsjCeS%2FER7%2BC0fllu8C3fXGIWnjCSiGGT7VNBTrmfoIIOrj5CGcFWqL9oHP7xu7mB7ebGq9w9Gq9pzK3eB1WjIn8u287QWf8%2BPG0LwjbppYviwK7%2B2sSvoptDR%2FODiJLGsQ6THAhb8VMM8sPG2KXuXGEWul%2BMm98WXEUiHPUSnc%2BP%2BeY93%2FCc%2FiDTlnxnz6Pybc9poFy1EoJtzLy4ugv5HtVADo7svZ9m6n4LCaW2ckRdFoFeBK1UtJ49ywJ3HoV12DPoEgkEiQ6%2BIzu3bvXqUBn9PDegBpXSpKvlCRrVG5HFG9ym5QgQQcg6fThydfKvr2gCUfigcTtmp%2FIhmOmsXw7l66YvZ87R6PRLIlw16jcivN8seZpia%2BZwzKymaZbPsRgpWU6H%2BhkyWNJHR3uzsk8u3jxYpOATs7uT9Qq9%2FPHZrUTdCZMkOmd9XUxja585g2Z4MIsQ%2BawlsfVK5Dl%2FLGMJYhzyEbjn%2BYPOmqlBHeYM9%2F5547N5Qk6afLv0r%2FPke9VZikPbc1UpKbvXr91J3N0eHqMWbsmzsNtKNy2%2FtdTLaLEu2d%2Frdl%2F9IfvwAolLqGyfl8BdJiPyQpAp3s3W9bHyZoJpII2%2FcpORf8x%2FcMiFGt5J0cxCTq7Ng3XqNx%2B%2FeVn2I5BmsbRqNy4hToXCTDqeNDJU0zSqNwQxaDmLs4OIR9OPXfuNJNO9uzZEx8fn5SUdPDgQebZjs%2BxUojhU21LAJ3y8vL09PTU1NTc3Nyqqirm883Pz09ISFiyZMmVK1f0SnRKTye0E3S09Zf%2B7%2F%2F%2B73%2F%2F93%2BZL3r%2BOWq1%2BtzxjzoGdDj0cniyDiu46HopcWwvHz28d0z44LREl5VLXzFoRYPjs57AUwaBjlopuXxmeWNDJTmDVl07cOpwIFKOXonOt7u%2B%2F3bX99t379lfoN64LSMlbXtK2g5mb3%2FvvakURe3fF6dWSn4%2Bs6q5uZmiqCslKWqlZGbQAD6%2BrgTQIR8Tpi1domME6FwpSYavB%2FDBH3Rg3QpxoTjPF4U0kDh%2FPBQwCJsPEjTxj4WADry%2FXJwdVMo95Ny2bNmyECIkJSWRZ%2FWmf%2F31T%2B%2BSDQ0NesvzKcCHGKy0jKlAp66uLj8%2FPycnJz8%2Fv6